# EAGLE design quadcopter (EAGLE 8.1.0)
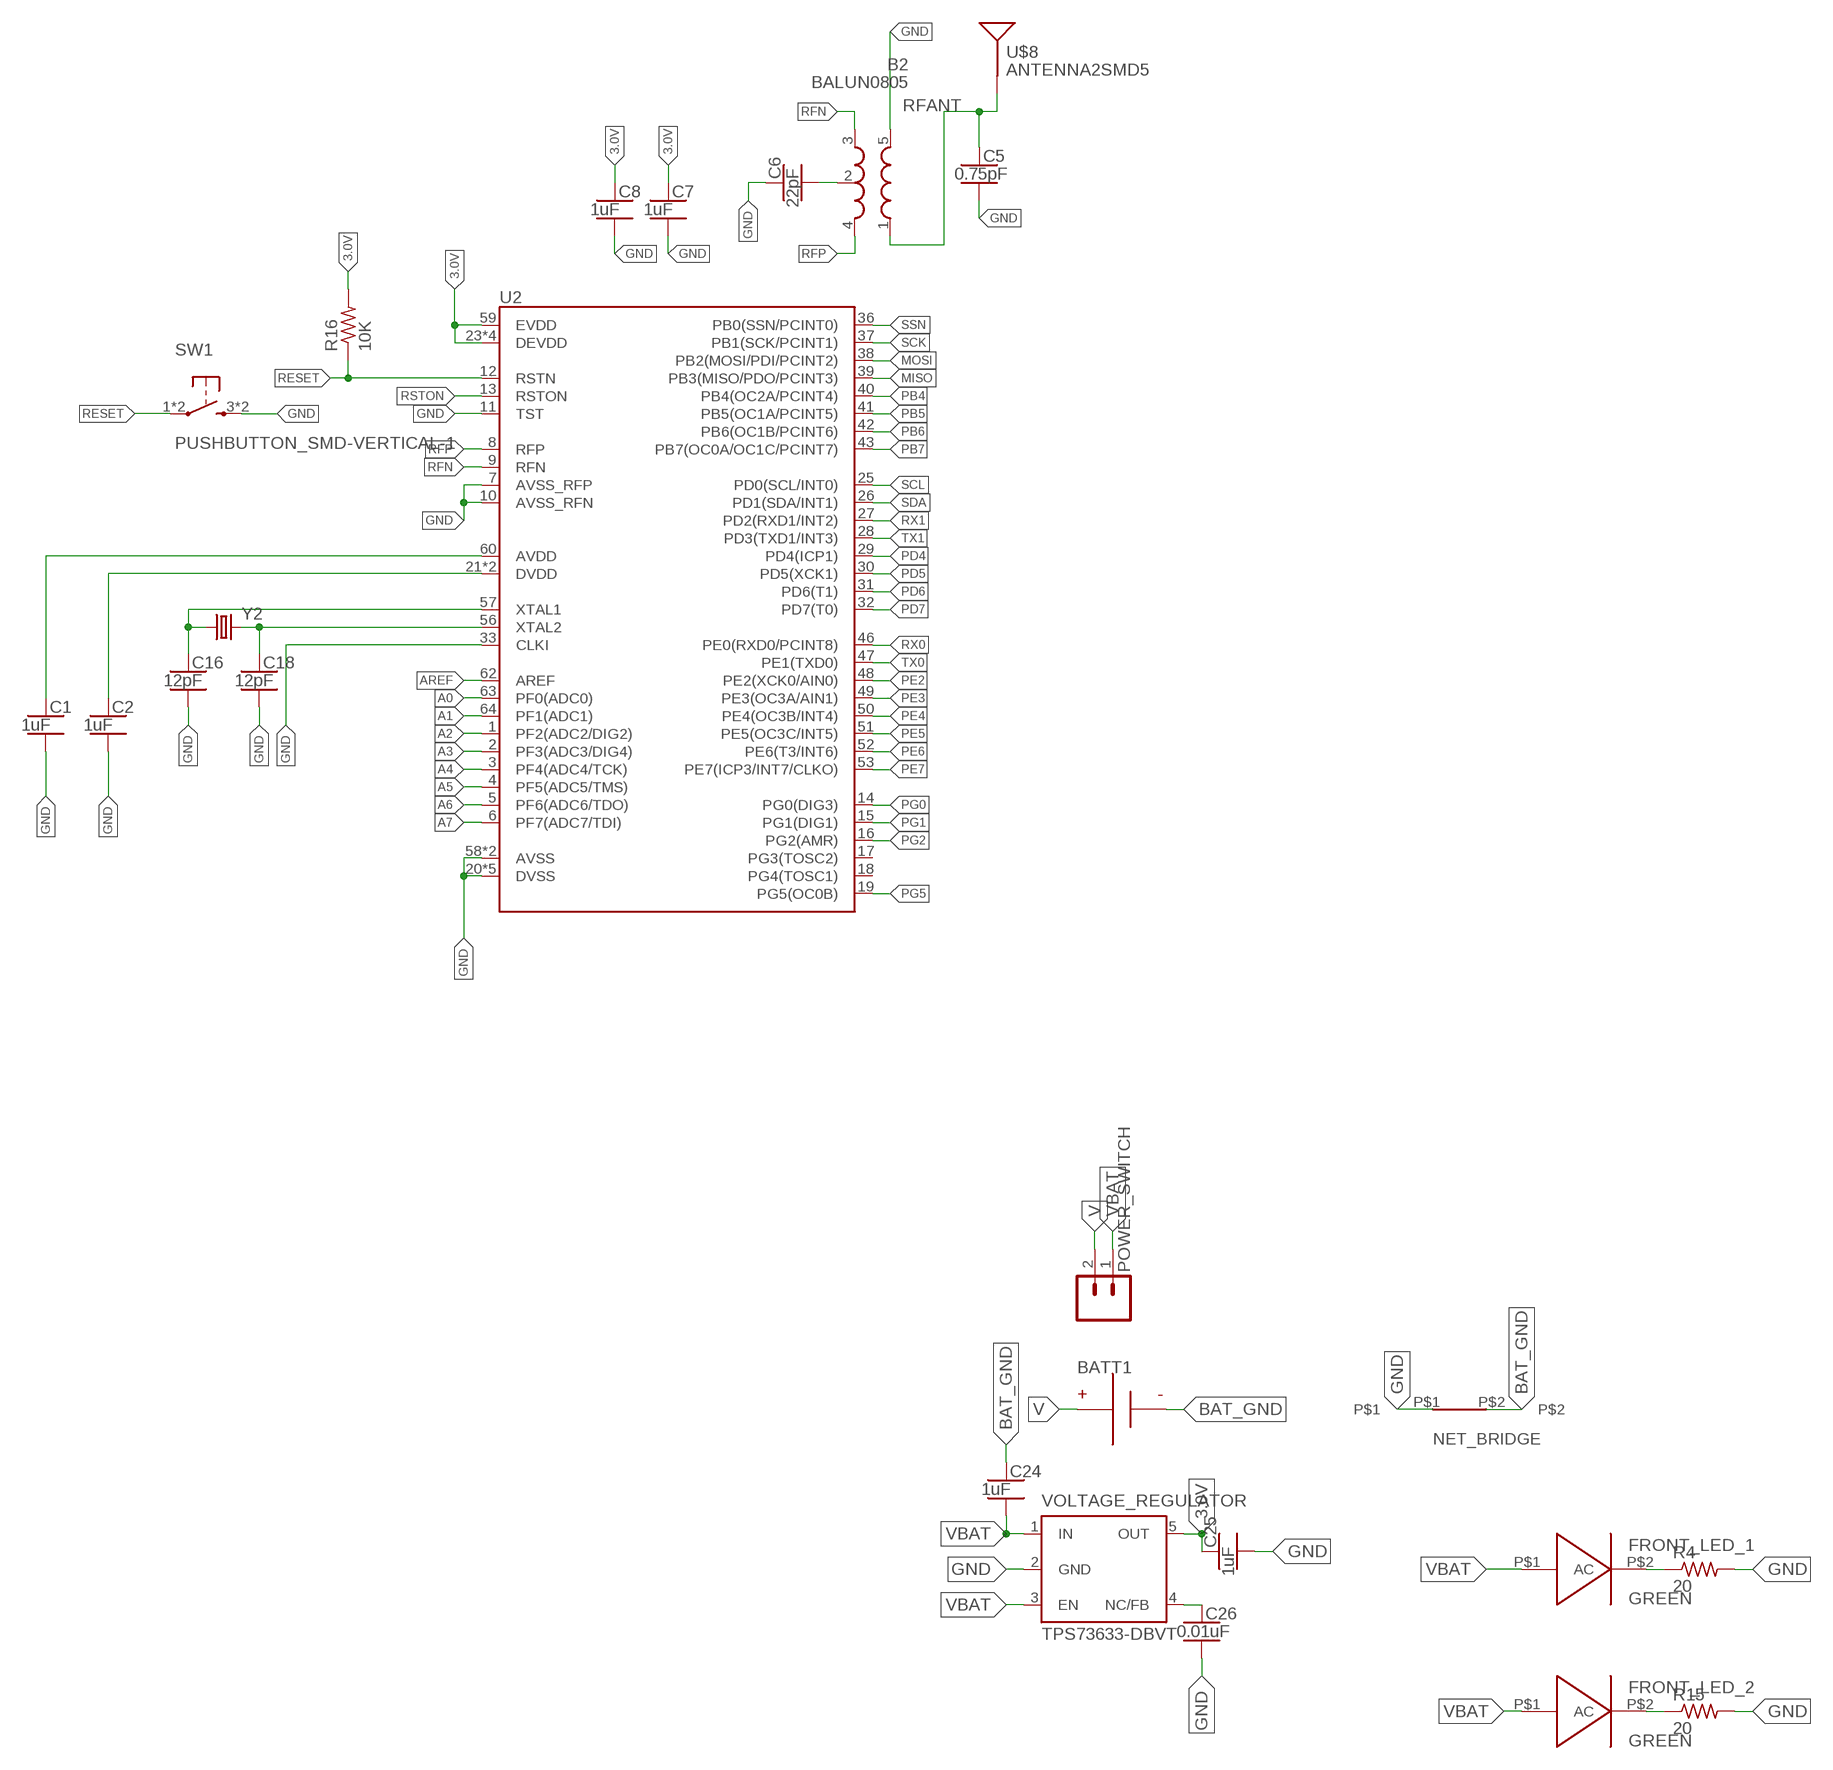
[diagram p0: schematic, sheet 1, part 1 of 2]
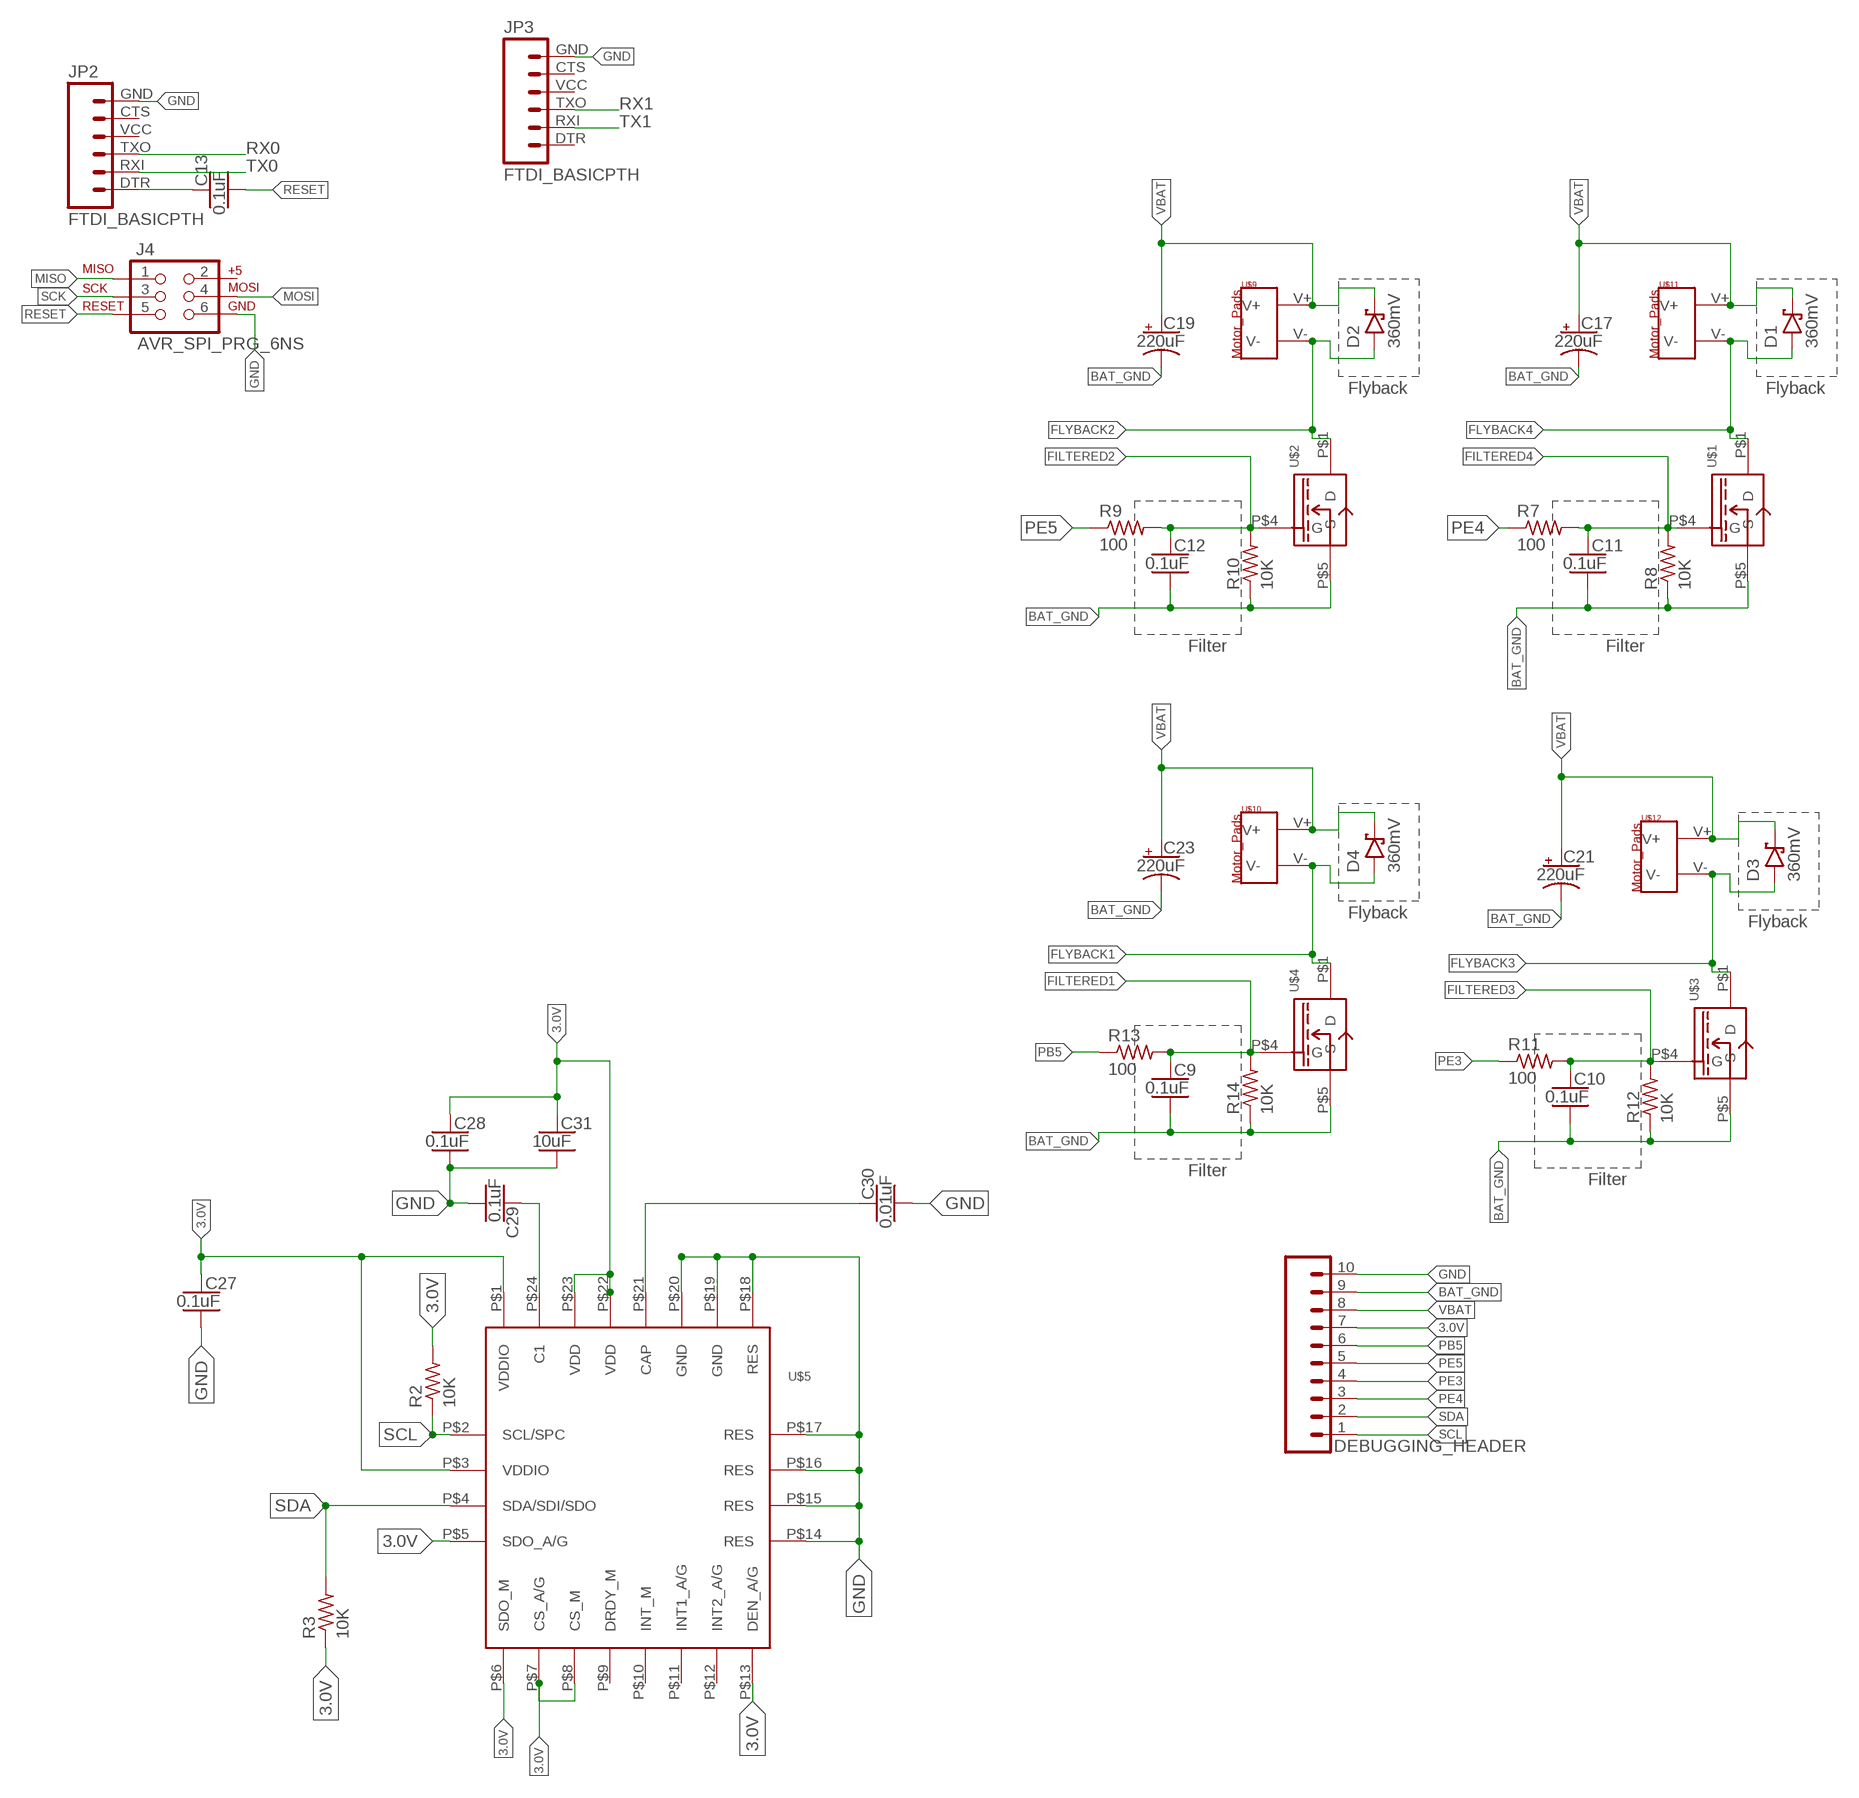
[diagram p1: schematic, sheet 1, part 2 of 2]

## Parts
B2  BALUN0805  [BALUN]
BATT1  BATTERY-HUBSAN-W/HOLDER  [BATTERY-W/HOLDER-380MAH-HUBSAN]
C1  1uF  CAPACITOR-NP_SMD-2012-0805_CERAMIC-1UF  [CAPC2012X140_HS]
C2  1uF  CAPACITOR-NP_SMD-2012-0805_CERAMIC-1UF  [CAPC2012X140_HS]
C5  0.75pF  CAPACITOR-NP_SMD-2012-0805_CERAMIC-0.75PF  [CAPC2012X140_HS]
C6  22pF  CAPACITOR-NP_SMD-2012-0805_CERAMIC-22PF  [CAPC2012X140_HS]
C7  1uF  CAPACITOR-NP_SMD-2012-0805_CERAMIC-1UF  [CAPC2012X140_HS]
C8  1uF  CAPACITOR-NP_SMD-2012-0805_CERAMIC-1UF  [CAPC2012X140_HS]
C9  0.1uF  CAPACITOR-NP_SMD-2012-0805_CERAMIC-0.1UF  [CAPC2012X140_HS]
C10  0.1uF  CAPACITOR-NP_SMD-2012-0805_CERAMIC-0.1UF  [CAPC2012X140_HS]
C11  0.1uF  CAPACITOR-NP_SMD-2012-0805_CERAMIC-0.1UF  [CAPC2012X140_HS]
C12  0.1uF  CAPACITOR-NP_SMD-2012-0805_CERAMIC-0.1UF  [CAPC2012X140_HS]
C13  0.1uF  CAPACITOR-NP_SMD-2012-0805_CERAMIC-0.1UF  [CAPC2012X140_HS]
C16  12pF  CAPACITOR-NP_SMD-2012-0805_CERAMIC-12PF  [CAPC2012X140_HS]
C17  220uF  CAPACITOR-POL_SMD-7043-D_TANTALUM-220UF  [CAPMP7343X310_HS]
C18  12pF  CAPACITOR-NP_SMD-2012-0805_CERAMIC-12PF  [CAPC2012X140_HS]
C19  220uF  CAPACITOR-POL_SMD-7043-D_TANTALUM-220UF  [CAPMP7343X310_HS]
C21  220uF  CAPACITOR-POL_SMD-7043-D_TANTALUM-220UF  [CAPMP7343X310_HS]
C23  220uF  CAPACITOR-POL_SMD-7043-D_TANTALUM-220UF  [CAPMP7343X310_HS]
C24  1uF  CAPACITOR-NP_SMD-2012-0805_CERAMIC-1UF  [CAPC2012X140_HS]
C25  1uF  CAPACITOR-NP_SMD-2012-0805_CERAMIC-1UF  [CAPC2012X140_HS]
C26  0.01uF  CAPACITOR-NP_SMD-2012-0805_CERAMIC-0.01UF  [CAPC2012X140_HS]
C27  0.1uF  CAPACITOR-NP_SMD-2012-0805_CERAMIC-0.1UF  [CAPC2012X140_HS]
C28  0.1uF  CAPACITOR-NP_SMD-2012-0805_CERAMIC-0.1UF  [CAPC2012X140_HS]
C29  0.1uF  CAPACITOR-NP_SMD-2012-0805_CERAMIC-0.1UF  [CAPC2012X140_HS]
C30  0.01uF  CAPACITOR-NP_SMD-2012-0805_CERAMIC-0.01UF  [CAPC2012X140_HS]
C31  10uF  CAPACITOR-NP_SMD-2012-0805_CERAMIC-10UF  [CAPC2012X140_HS]
D1  360mV  DIODE-SCHOTTKY_SMD-SOD123-360MV  [SOD3716X135_HS]
D2  360mV  DIODE-SCHOTTKY_SMD-SOD123-360MV  [SOD3716X135_HS]
D3  360mV  DIODE-SCHOTTKY_SMD-SOD123-360MV  [SOD3716X135_HS]
D4  360mV  DIODE-SCHOTTKY_SMD-SOD123-360MV  [SOD3716X135_HS]
DEBUGGING_HEADER  SIP-10_TH-254X10-1  [HDRV10W63P254_10X1_2540X254H838_HS]
FRONT_LED_1  GREEN  LED-0805-GREEN  [KINGBRIGHT_LED]
FRONT_LED_2  GREEN  LED-0805-GREEN  [KINGBRIGHT_LED]
J4  AVR_SPI_PRG_6NS  [2X3-NS]
JP2  FTDI_BASICPTH  [FTDI_BASIC]
JP3  FTDI_BASICPTH  [FTDI_BASIC]
NET_BRIDGE  NET_BRIDGE  [NET_BRIDGE]
POWER_SWITCH  MALE_HEADER_2POS-2X1-0.1IN  [MALE_HEADER_2X1_0.1IN]
R2  10K  RESISTOR_SMD-2012-0805-10K  [RESC2012X60_HS]
R3  10K  RESISTOR_SMD-2012-0805-10K  [RESC2012X60_HS]
R4  20  RESISTOR_SMD-2012-0805-20  [RESC2012X60_HS]
R7  100  RESISTOR_SMD-2012-0805-100  [RESC2012X60_HS]
R8  10K  RESISTOR_SMD-2012-0805-10K  [RESC2012X60_HS]
R9  100  RESISTOR_SMD-2012-0805-100  [RESC2012X60_HS]
R10  10K  RESISTOR_SMD-2012-0805-10K  [RESC2012X60_HS]
R11  100  RESISTOR_SMD-2012-0805-100  [RESC2012X60_HS]
R12  10K  RESISTOR_SMD-2012-0805-10K  [RESC2012X60_HS]
R13  100  RESISTOR_SMD-2012-0805-100  [RESC2012X60_HS]
R14  10K  RESISTOR_SMD-2012-0805-10K  [RESC2012X60_HS]
R15  20  RESISTOR_SMD-2012-0805-20  [RESC2012X60_HS]
R16  10K  RESISTOR_SMD-2012-0805-10K  [RESC2012X60_HS]
SW1  PUSHBUTTON_SMD-VERTICAL-1  [TE_FSM8JSMA_HS]
U2  ATMEGA128RFA1  [QFN-64]
U$1  MOFSET_SI2302CDS-T1-E3CT-ND  [MOFSET_SI2302CDS-T1-E3CT-ND]
U$2  MOFSET_SI2302CDS-T1-E3CT-ND  [MOFSET_SI2302CDS-T1-E3CT-ND]
U$3  MOFSET_SI2302CDS-T1-E3CT-ND  [MOFSET_SI2302CDS-T1-E3CT-ND]
U$4  MOFSET_SI2302CDS-T1-E3CT-ND  [MOFSET_SI2302CDS-T1-E3CT-ND]
U$5  IMU_497-14946-1-ND  [IMU_497-14946-1-ND]
U$8  ANTENNA2SMD5  [ANTENNA-CHIP5]
U$9  MOTOR_PADS  [MOTOR_PADS]
U$10  MOTOR_PADS  [MOTOR_PADS]
U$11  MOTOR_PADS  [MOTOR_PADS]
U$12  MOTOR_PADS  [MOTOR_PADS]
VOLTAGE_REGULATOR  TPS73633-DBVT  [SOT23-DBV]
Y2  CRYSTAL5X3  [CRYSTAL-SMD-5X3]

## Nets
3.0V: C7.1 C8.1 C25.1 C27.1 C28.1 C31.1 DEBUGGING_HEADER.7 R2.2 R3.1 R16.2 U2.23(DEVDD) U2.34(DEVDD) U2.44(DEVDD) U2.54(DEVDD) U2.59(EVDD) U$5.P$1(VDDIO) U$5.P$3(VDDIO) U$5.P$5(SDO_A/G) U$5.P$6(SDO_M) U$5.P$7(CS_A/G) U$5.P$8(CS_M) U$5.P$13(DEN_A/G) U$5.P$22(VDD) U$5.P$23(VDD) VOLTAGE_REGULATOR.5(OUT)
A0: U2.63(PF0(ADC0))
A1: U2.64(PF1(ADC1))
A2: U2.1(PF2(ADC2/DIG2))
A3: U2.2(PF3(ADC3/DIG4))
A4: U2.3(PF4(ADC4/TCK))
A5: U2.4(PF5(ADC5/TMS))
A6: U2.5(PF6(ADC6/TDO))
A7: U2.6(PF7(ADC7/TDI))
AREF: U2.62(AREF)
AVDD: C1.1 U2.60(AVDD)
BAT_GND [HIGHCURRENT]: BATT1.-(N) C9.2 C10.2 C11.2 C12.2 C17.2(-) C19.2(-) C21.2(-) C23.2(-) C24.1 DEBUGGING_HEADER.9 NET_BRIDGE.P$2 R8.1 R10.1 R12.1 R14.1 U$1.P$5(S) U$2.P$5(S) U$3.P$5(S) U$4.P$5(S)
DTR: C13.1 JP2.DTR
DVDD: C2.1 U2.21(DVDD) U2.22(DVDD)
FILTERED1 [HIGHCURRENT]: C9.1 R13.2 R14.2 U$4.P$4(G)
FILTERED2 [HIGHCURRENT]: C12.1 R9.2 R10.2 U$2.P$4(G)
FILTERED3 [HIGHCURRENT]: C10.1 R11.2 R12.2 U$3.P$4(G)
FILTERED4 [HIGHCURRENT]: C11.1 R7.2 R8.2 U$1.P$4(G)
FLYBACK1 [HIGHCURRENT]: D4.A U$4.P$1(D) U$10.V-
FLYBACK2 [HIGHCURRENT]: D2.A U$2.P$1(D) U$9.V-
FLYBACK3 [HIGHCURRENT]: D3.A U$3.P$1(D) U$12.V-
FLYBACK4 [HIGHCURRENT]: D1.A U$1.P$1(D) U$11.V-
GND: B2.5(GND) C1.2 C2.2 C5.2 C6.1 C7.2 C8.2 C16.2 C18.2 C25.2 C26.2 C27.2 C28.2 C29.2 C30.2 C31.2 DEBUGGING_HEADER.10 J4.6 JP2.GND JP3.GND NET_BRIDGE.P$1 R4.2 R15.2 SW1.3 SW1.4 U2.7(AVSS_RFP) U2.10(AVSS_RFN) U2.11(TST) U2.20(DVSS) U2.24(DVSS) U2.33(CLKI) U2.35(DVSS) U2.45(DVSS) U2.55(DVSS) U2.58(AVSS) U2.61(AVSS) U$5.P$14(RES) U$5.P$15(RES) U$5.P$16(RES) U$5.P$17(RES) U$5.P$18(RES) U$5.P$19(GND) U$5.P$20(GND) VOLTAGE_REGULATOR.2(GND)
MISO: J4.1 U2.39(PB3(MISO/PDO/PCINT3))
MOSI: J4.4 U2.38(PB2(MOSI/PDI/PCINT2))
N$1: FRONT_LED_1.P$2(C) R4.1
N$2: C30.1 U$5.P$21(CAP)
N$5: FRONT_LED_2.P$2(C) R15.1
N$7: B2.2(GND) C6.2
N$10: C29.1 U$5.P$24(C1)
N$12: C16.1 U2.57(XTAL1) Y2.1
N$14: C18.1 U2.56(XTAL2) Y2.3
N$18: C26.1 VOLTAGE_REGULATOR.4(NC/FB)
PB4: U2.40(PB4(OC2A/PCINT4))
PB5: DEBUGGING_HEADER.6 R13.1 U2.41(PB5(OC1A/PCINT5))
PB6: U2.42(PB6(OC1B/PCINT6))
PB7: U2.43(PB7(OC0A/OC1C/PCINT7))
PD4: U2.29(PD4(ICP1))
PD5: U2.30(PD5(XCK1))
PD6: U2.31(PD6(T1))
PD7: U2.32(PD7(T0))
PE2: U2.48(PE2(XCK0/AIN0))
PE3: DEBUGGING_HEADER.4 R11.1 U2.49(PE3(OC3A/AIN1))
PE4: DEBUGGING_HEADER.3 R7.1 U2.50(PE4(OC3B/INT4))
PE5: DEBUGGING_HEADER.5 R9.1 U2.51(PE5(OC3C/INT5))
PE6: U2.52(PE6(T3/INT6))
PE7: U2.53(PE7(ICP3/INT7/CLKO))
PG0: U2.14(PG0(DIG3))
PG1: U2.15(PG1(DIG1))
PG2: U2.16(PG2(AMR))
PG5: U2.19(PG5(OC0B))
RESET: C13.2 J4.5 R16.1 SW1.1 SW1.2 U2.12(RSTN)
RFANT [RFSIG]: B2.1(IN) C5.1 U$8.FEED(SIGNAL)
RFN: B2.3(OUT2) U2.9(RFN)
RFP: B2.4(OUT1) U2.8(RFP)
RSTON: U2.13(RSTON)
RX0: JP2.TXO U2.46(PE0(RXD0/PCINT8))
RX1: JP3.TXO U2.27(PD2(RXD1/INT2))
SCK: J4.3 U2.37(PB1(SCK/PCINT1))
SCL: DEBUGGING_HEADER.1 R2.1 U2.25(PD0(SCL/INT0)) U$5.P$2(SCL/SPC)
SDA: DEBUGGING_HEADER.2 R3.2 U2.26(PD1(SDA/INT1)) U$5.P$4(SDA/SDI/SDO)
SSN: U2.36(PB0(SSN/PCINT0))
TX0: JP2.RXI U2.47(PE1(TXD0))
TX1: JP3.RXI U2.28(PD3(TXD1/INT3))
V: BATT1.+(P) POWER_SWITCH.2
VBAT [HIGHCURRENT]: C17.1(+) C19.1(+) C21.1(+) C23.1(+) C24.2 D1.C D2.C D3.C D4.C DEBUGGING_HEADER.8 FRONT_LED_1.P$1(A) FRONT_LED_2.P$1(A) POWER_SWITCH.1 U$9.V+ U$10.V+ U$11.V+ U$12.V+ VOLTAGE_REGULATOR.1(IN) VOLTAGE_REGULATOR.3(EN)
Unconnected: J4.2 JP2.CTS JP2.VCC JP3.CTS JP3.DTR JP3.VCC U2.17(PG3(TOSC2)) U2.18(PG4(TOSC1)) U$5.P$9(DRDY_M) U$5.P$10(INT_M) U$5.P$11(INT1_A/G) U$5.P$12(INT2_A/G)

## Notes on the sheet
- Flyback | Flyback
- Filter | Filter
- Flyback
- Flyback
- Filter
- Filter

## Library data of the parts
B2 = quadparts_prebuilt:BALUN: 0805 footprint balun- Ember 351/357; DATASHEET: http://katalog.we-online.de/pbs/datasheet/748421245.pdf; DIST: Digikey; DISTPN: 732-2230-6-ND; MFR: Wurth Electronics Inc; MPN: 748421245; PRICE: 2.63
BATT1 = quadparts_prebuilt:BATTERY; CREATOR: Swanson; DIST: AMAZON; DISTPN: http://www.amazon.com/dp/B00RROB6Q4?smid=AMNTPWSAB5H0S; MFR: HUBSAN; MPN: X4-H107C-8-in-1
C1 C2 C7 C8 C24 C25 = quadparts_prebuilt:CAPACITOR-NP_: Nonpolarized capacitor; DIST: Digikey; DISTPN: 490-4736-1-ND; MFR: Murata Electronics North America; MPN: GRM21BR71H105KA12L
C5 = quadparts_prebuilt:CAPACITOR-NP_: Nonpolarized capacitor; DIST: Digikey; DISTPN: 490-3585-1-ND; MFR: Murata Electronics North America; MPN: GQM2195C2AR75CB01D
C6 = quadparts_prebuilt:CAPACITOR-NP_: Nonpolarized capacitor; DIST: Digikey; DISTPN: 490-5534-1-ND; MFR: Murata Electronics North America; MPN: GRM21A5C2E220JW01D
C9-C13 C27-C29 = quadparts_prebuilt:CAPACITOR-NP_: Nonpolarized capacitor; DIST: Digikey; DISTPN: 490-1666-1-ND; MFR: Murata Electronics North America; MPN: GRM21BR71H104KA01L
C16 C18 = quadparts_prebuilt:CAPACITOR-NP_: Nonpolarized capacitor; DIST: Digikey; DISTPN: 490-5531-1-ND; MFR: Murata Electronics North America; MPN: GRM21A5C2E120JW01D
C17 C19 C21 C23 = quadparts_prebuilt:CAPACITOR-POL_: Polarized capacitor; DIST: Digikey; DISTPN: 478-8912-1-ND; MFR: AVX Corporation; MPN: TAJD227K006RNJ
C26 C30 = quadparts_prebuilt:CAPACITOR-NP_: Nonpolarized capacitor; DIST: Digikey; DISTPN: 490-8295-1-ND; MFR: Murata Electronics North America; MPN: GRM2195C1H103FA01D
C31 = quadparts_prebuilt:CAPACITOR-NP_: Nonpolarized capacitor; DIST: Digikey; DISTPN: 490-5523-1-ND; MFR: Murata Electronics North America; MPN: GRM21BR61E106KA73L
D1-D4 = quadparts_prebuilt:DIODE-SCHOTTKY_: Schottky diode; DIST: Digikey; DISTPN: CRS08QMCT-ND; MFR: Toshiba Semiconductor and Storage; MPN: CRS08(TE85L,Q,M)
DEBUGGING_HEADER = quadparts_prebuilt:SIP-10_: 10 pin single inline pin header, socket, or connector; DIST: Digikey; DISTPN: 609-3250-ND; MFR: Amphenol FCI; MPN: 68000-110HLF
FRONT_LED_1 FRONT_LED_2 = LEDs:LED; CREATOR: Chris Miranda; DIST: Digikey; DISTPN: 754-1795-1-ND; MFR: Kingbright; MPN: APT2012ZGCK; REVIEWER: Group3
J4 = quadparts_prebuilt:AVR_SPI_PRG_6: AVR ISP 6 Pin This is the reduced ISP connector for AVR programming. Common on Arduino. This footprint will take up less PCB space and can be used with a 10-pin to 6-pin adapter such as SKU: BOB-08508; DATASHEET: http://portal.fciconnect.com/Comergent//fci/drawing/67996.pdf; DIST: Digikey; DISTPN: 609-3234-ND; MFR: Amphenol FCI; MPN: 67997-206HLF; PRICE: 0.31
JP2 JP3 = quadparts_prebuilt:FTDI_BASIC: FTDI Basic header with labels; DATASHEET: http://portal.fciconnect.com/Comergent//fci/drawing/68015.pdf; DIST: Digikey; DISTPN: 609-3327-ND; MFR: Amphenol FCI; MPN: 68016-406HLF; PRICE: 0.33
NET_BRIDGE = quadparts_jay:NET_BRIDGE; CREATOR: Chris Miranda; DIST: none; DISTPN: none; MFR: none; MPN: none; REVIEWER: Group3
POWER_SWITCH = quadparts_jay:MALE_HEADER_2POS: 2 pin single inline pin header, socket, or connector; CREATOR: SWANSON; DIST: Digikey; DISTPN: 3M9447-ND; MFR: 3M; MPN: 961102-6404-AR; REVIEWER: Group3
R2 R3 R8 R10 R12 R14 R16 = quadparts_prebuilt:RESISTOR_: Resistor; DIST: Digikey; DISTPN: 311-10KARCT-ND; MFR: Yageo; MPN: RC0805JR-0710KL
R4 R15 = quadparts_prebuilt:RESISTOR_: Resistor; CREATOR: Chris Miranda; DIST: Digikey; DPN: 311-20ARCT-ND; MFR: Yageo; MPN: RC0805JR-0720RL
R7 R9 R11 R13 = quadparts_prebuilt:RESISTOR_: Resistor; DIST: Digikey; DISTPN: 311-100ARCT-ND; MFR: Yageo; MPN: RC0805JR-07100RL
SW1 = quadparts_prebuilt:PUSHBUTTON_: Pushbutton with 2 pins shorting 1 to 2 and two extra mounting pins 3 & 4; DIST: Digikey; DISTPN: 450-1129-ND; MFR: TE Connectivity Alcoswitch Switches; MPN: FSM4JSMA
U2 = quadparts_prebuilt:ATMEGA128RFA1: ATmega128RFA1 8-bit AVR Microcontroller with Low Power 2.4GHz Transceiver for ZigBee and IEEE 802.15.4; CREATOR: Swanson; DATASHEET: http://www.atmel.com/Images/Atmel-8266-MCU_Wireless-ATmega128RFA1_Datasheet.pdf; DIST: Digikey; DISTPN: ATMEGA128RFA1-ZUR00DKR-ND; MFR: Atmel; MPN: ATMEGA128RFA1-ZUR00; PRICE: 10.21
U$1-U$4 = quadparts_jay:MOFSET_SI2302CDS-T1-E3CT-ND: This is a MOFSET I have no idea what a MOFSET does, but if you were looking for one, this is it.; CREATOR: Jay Ives; DIST: Digikey; DISTPN: SI2302CDS-T1-E3CT-ND; MFR: Vishay Siliconix; MPN: SI2302CDS-T1-E3; REVIEWER: Group3
U$5 = quadparts_jay:IMU_497-14946-1-ND; CREATOR: Jay Ives; DIST: Digikey; DISTPN: 497-14946-1-ND; MFR: STMicroelectronics; MPN: LSM9DS1TR; REVIEWER: Group3
U$8 = quadparts_prebuilt:ANTENNA2: Chip antenna Single endded antenna. Common with smaller chip antennas. CHIP4 package is the GPS Chip Antenna SKU: GPS-08418. CHIP5 package is 2.4GHz chip antenna SKU: WRL-00144.; DATASHEET: http://www.linxtechnologies.com/resources/data-guides/ant-xxx-chp-x.pdf; DIST: Digikey; DISTPN: ANT-2.45-CHPCT-ND; MFR: Linx Technologies Inc.; MPN: ANT-2.45-CHP-T; PRICE: 3.16
U$9-U$12 = quadparts_prebuilt:MOTOR_PADS; DIST: NA; DISTPN: NA; MFR: NA; MPN: NA
VOLTAGE_REGULATOR = quadparts_prebuilt:TPS73633-DBVT; DATASHEET: http://www.ti.com/lit/ds/symlink/lp3985.pdf; DIST: Digikey; DISTPN: LP3985IM5X-3.0/NOPBCT-ND; MFR: Texas Instruments; MPN: LP3985IM5X-3.0/NOPB; PRICE: 0.59
Y2 = quadparts_prebuilt:CRYSTAL: Various standard crystals. Proven footprints.; DATASHEET: http://www.abracon.com/Resonators/abm3b.pdf; DIST: Digikey; DISTPN: 535-9122-1-ND; MFR: Abracon LLC; MPN: ABM3B-16.000MHZ-B2-T; PRICE: 0.68; PROD_ID: XTAL-08218

## Net classes
1 RFSIG: width 0.457 mm
2 HIGHCURRENT: width 0.457 mm

## Board
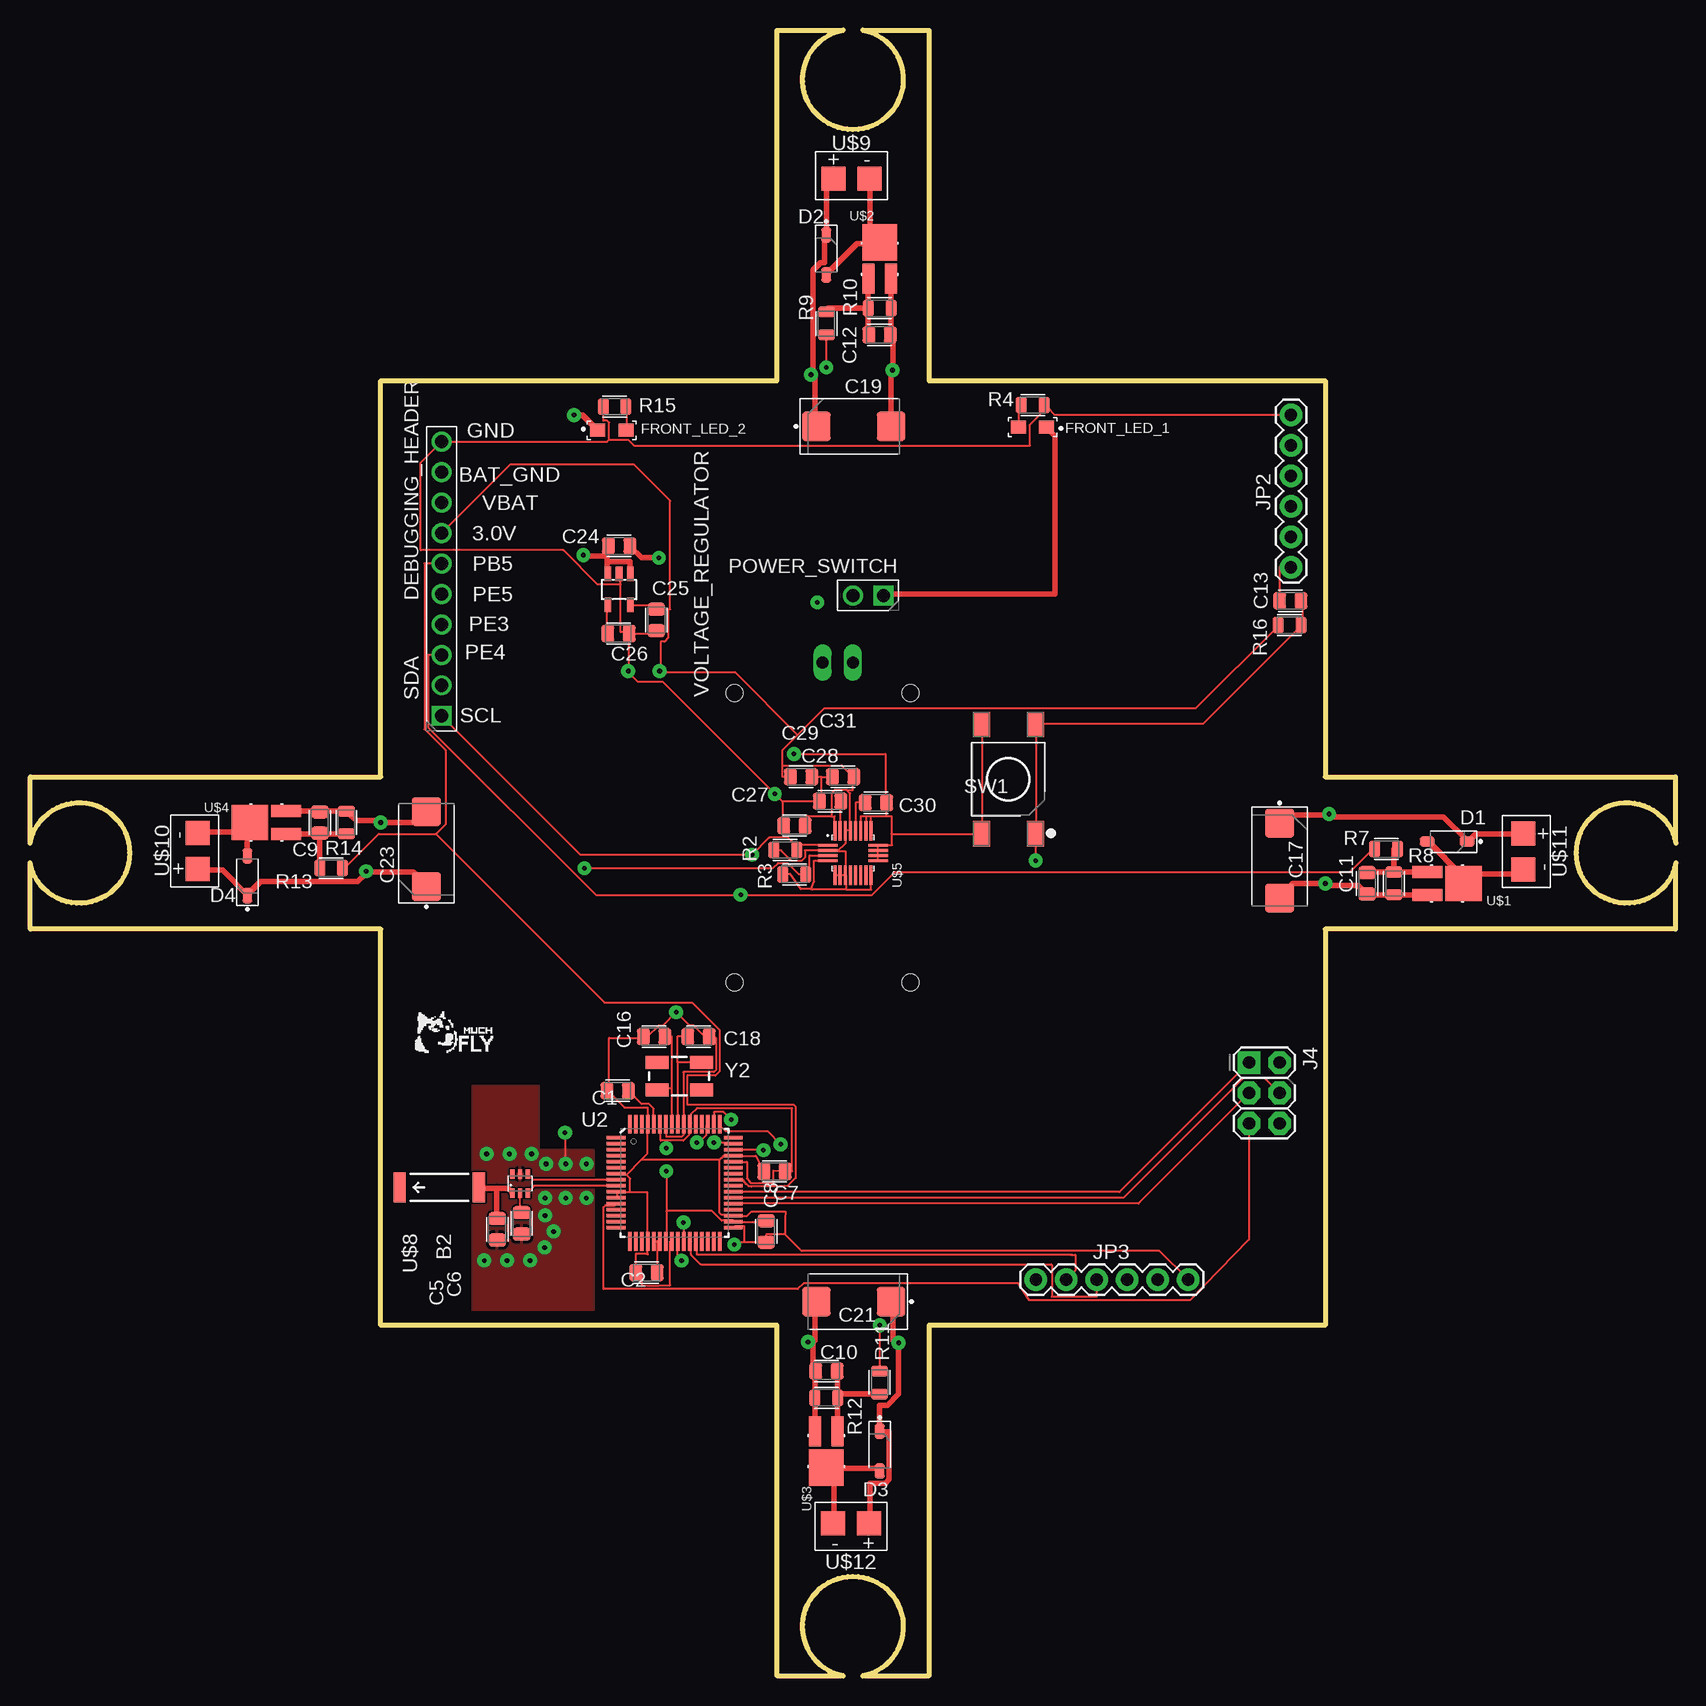
[diagram p2: board, top side]
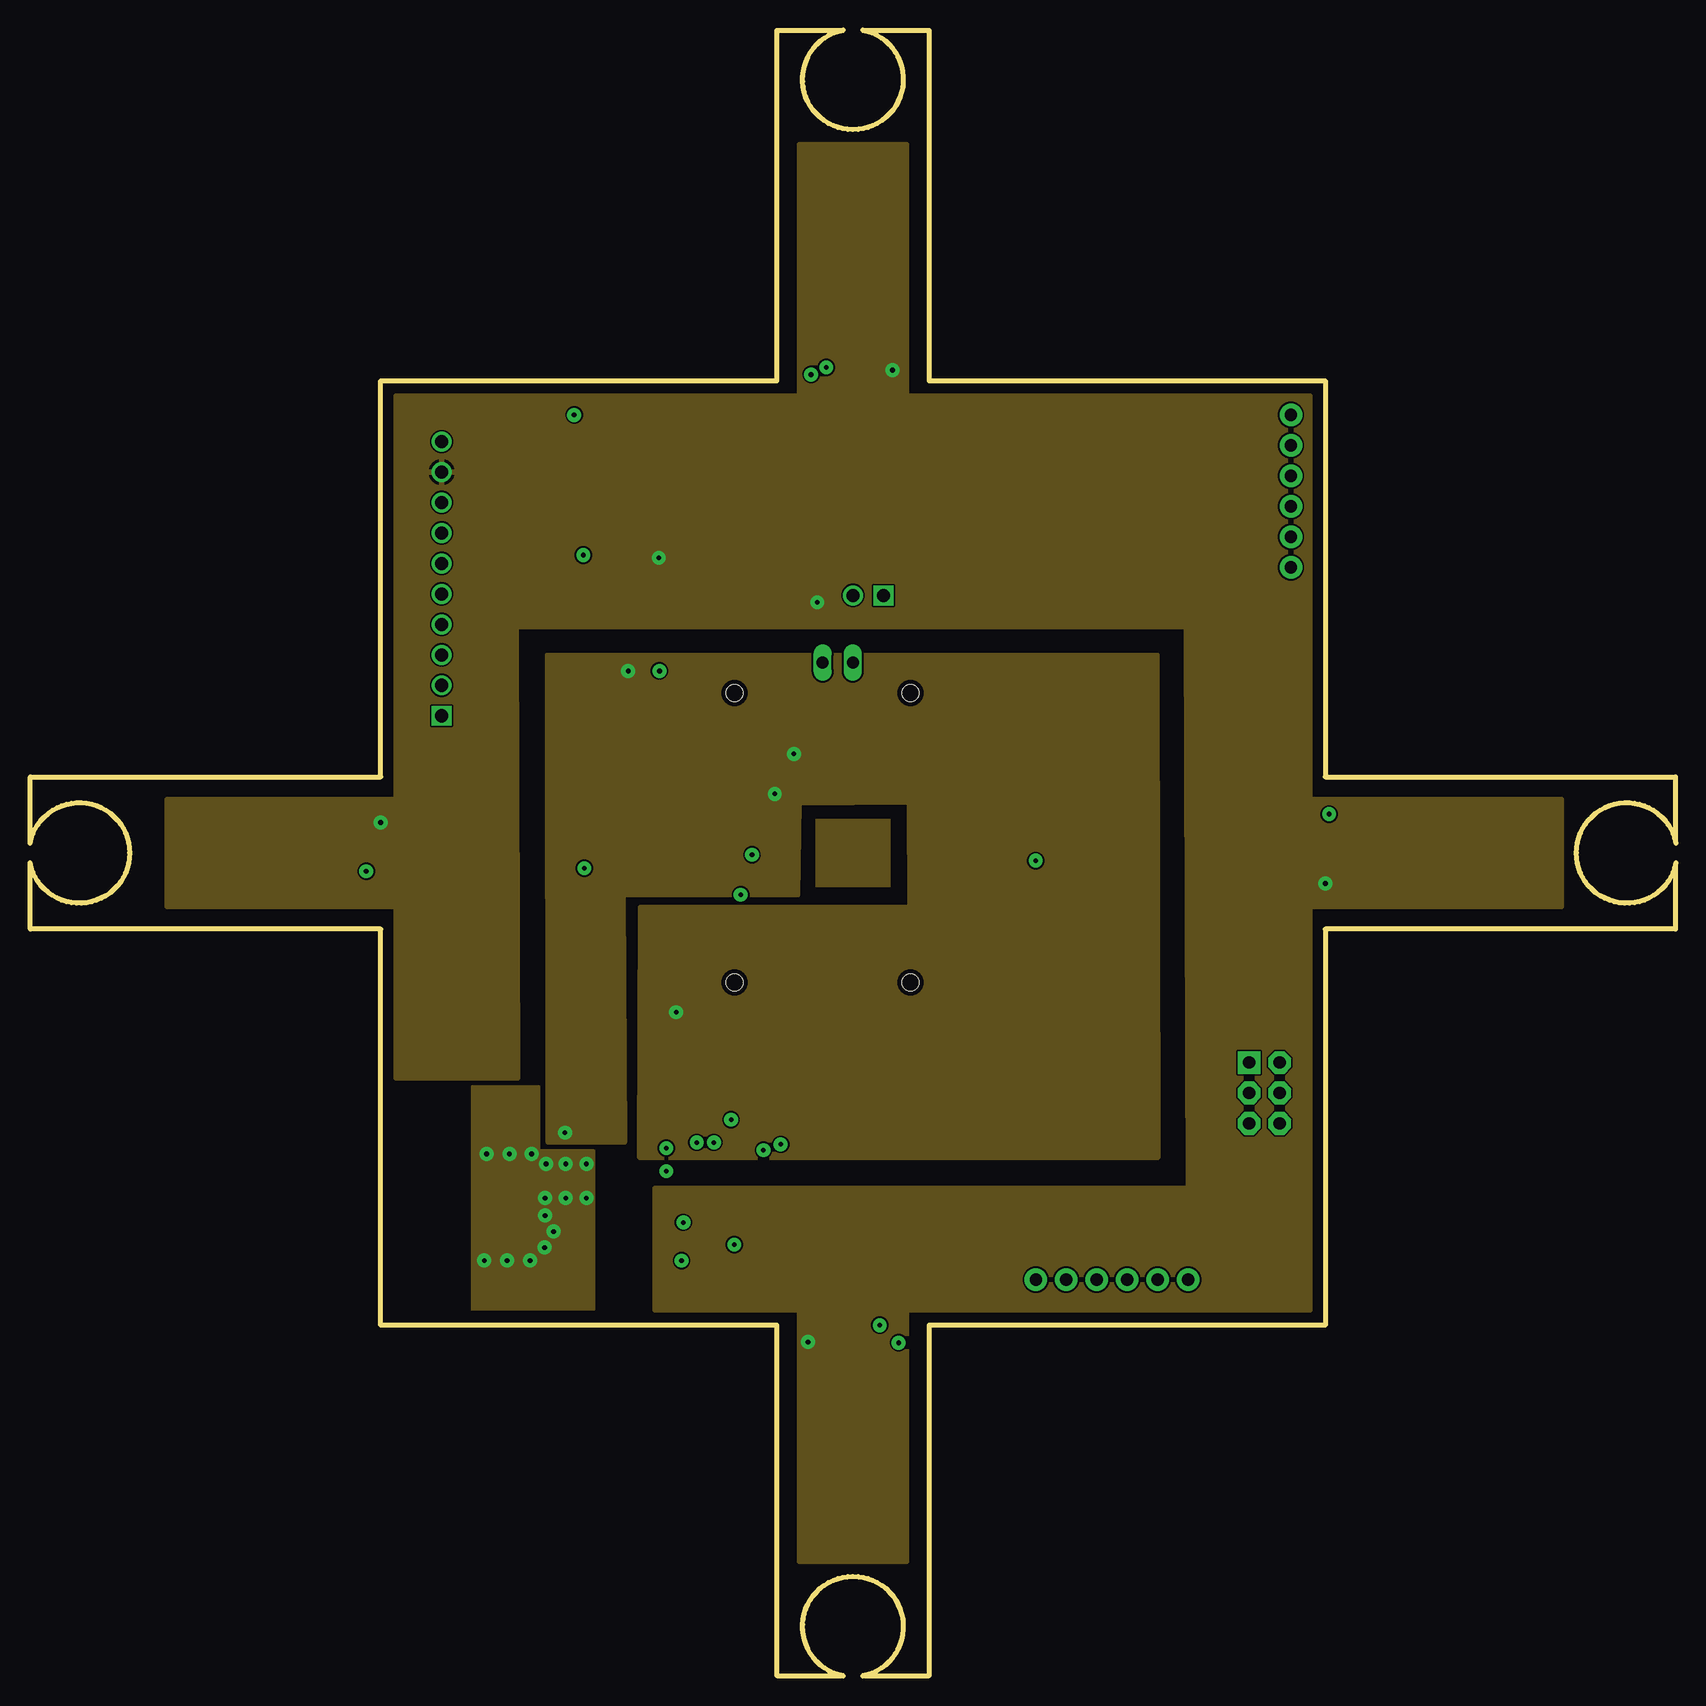
[diagram p3: board, inner layer Route2]
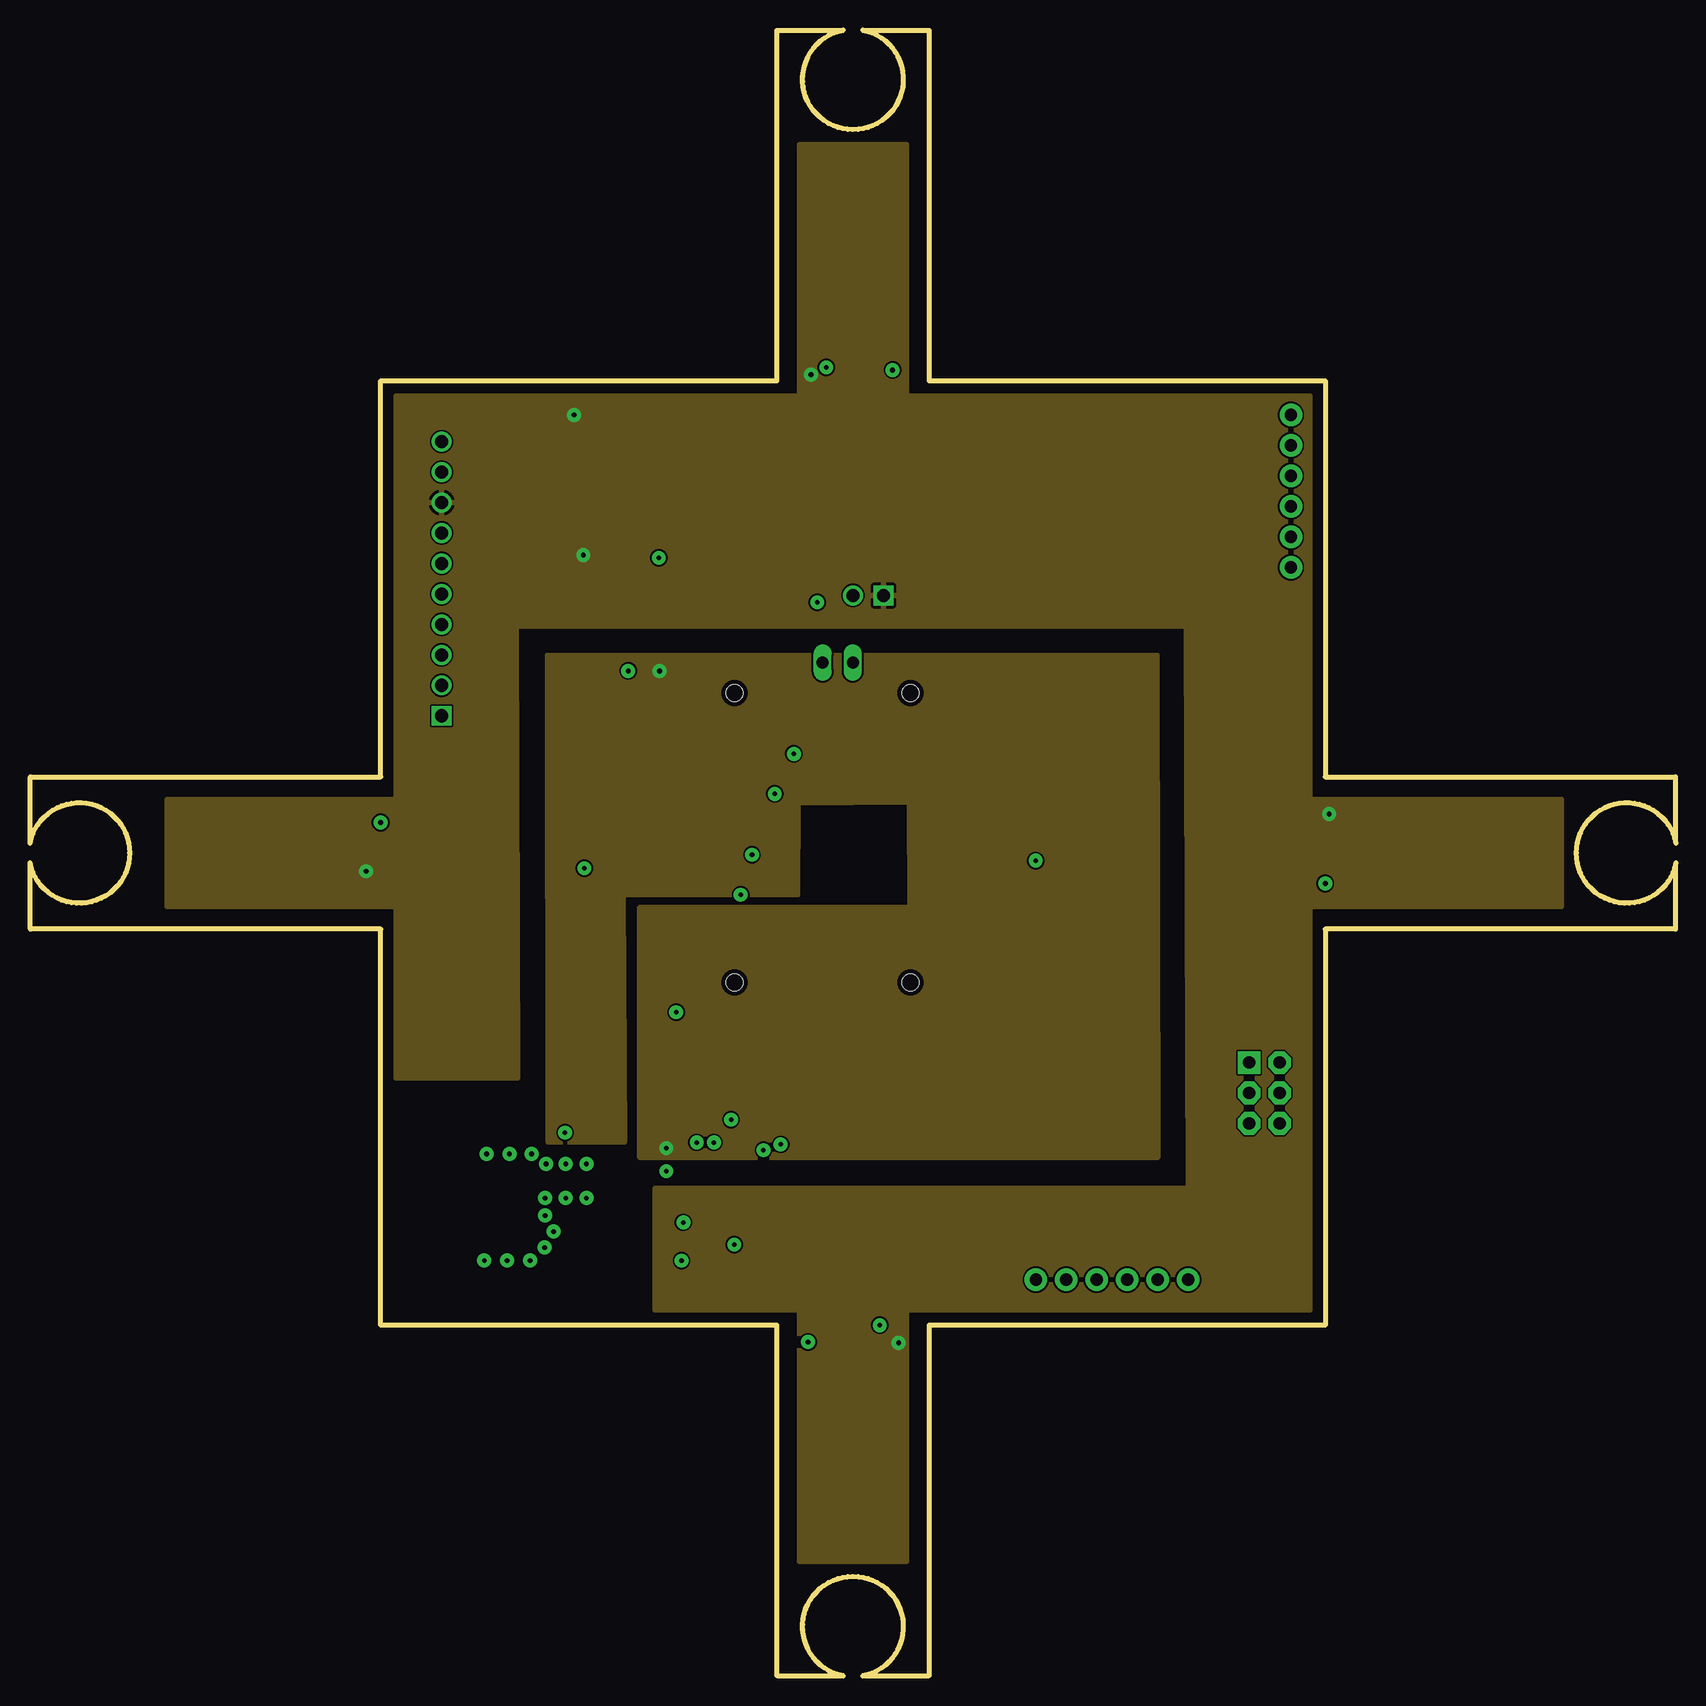
[diagram p4: board, inner layer Route15]
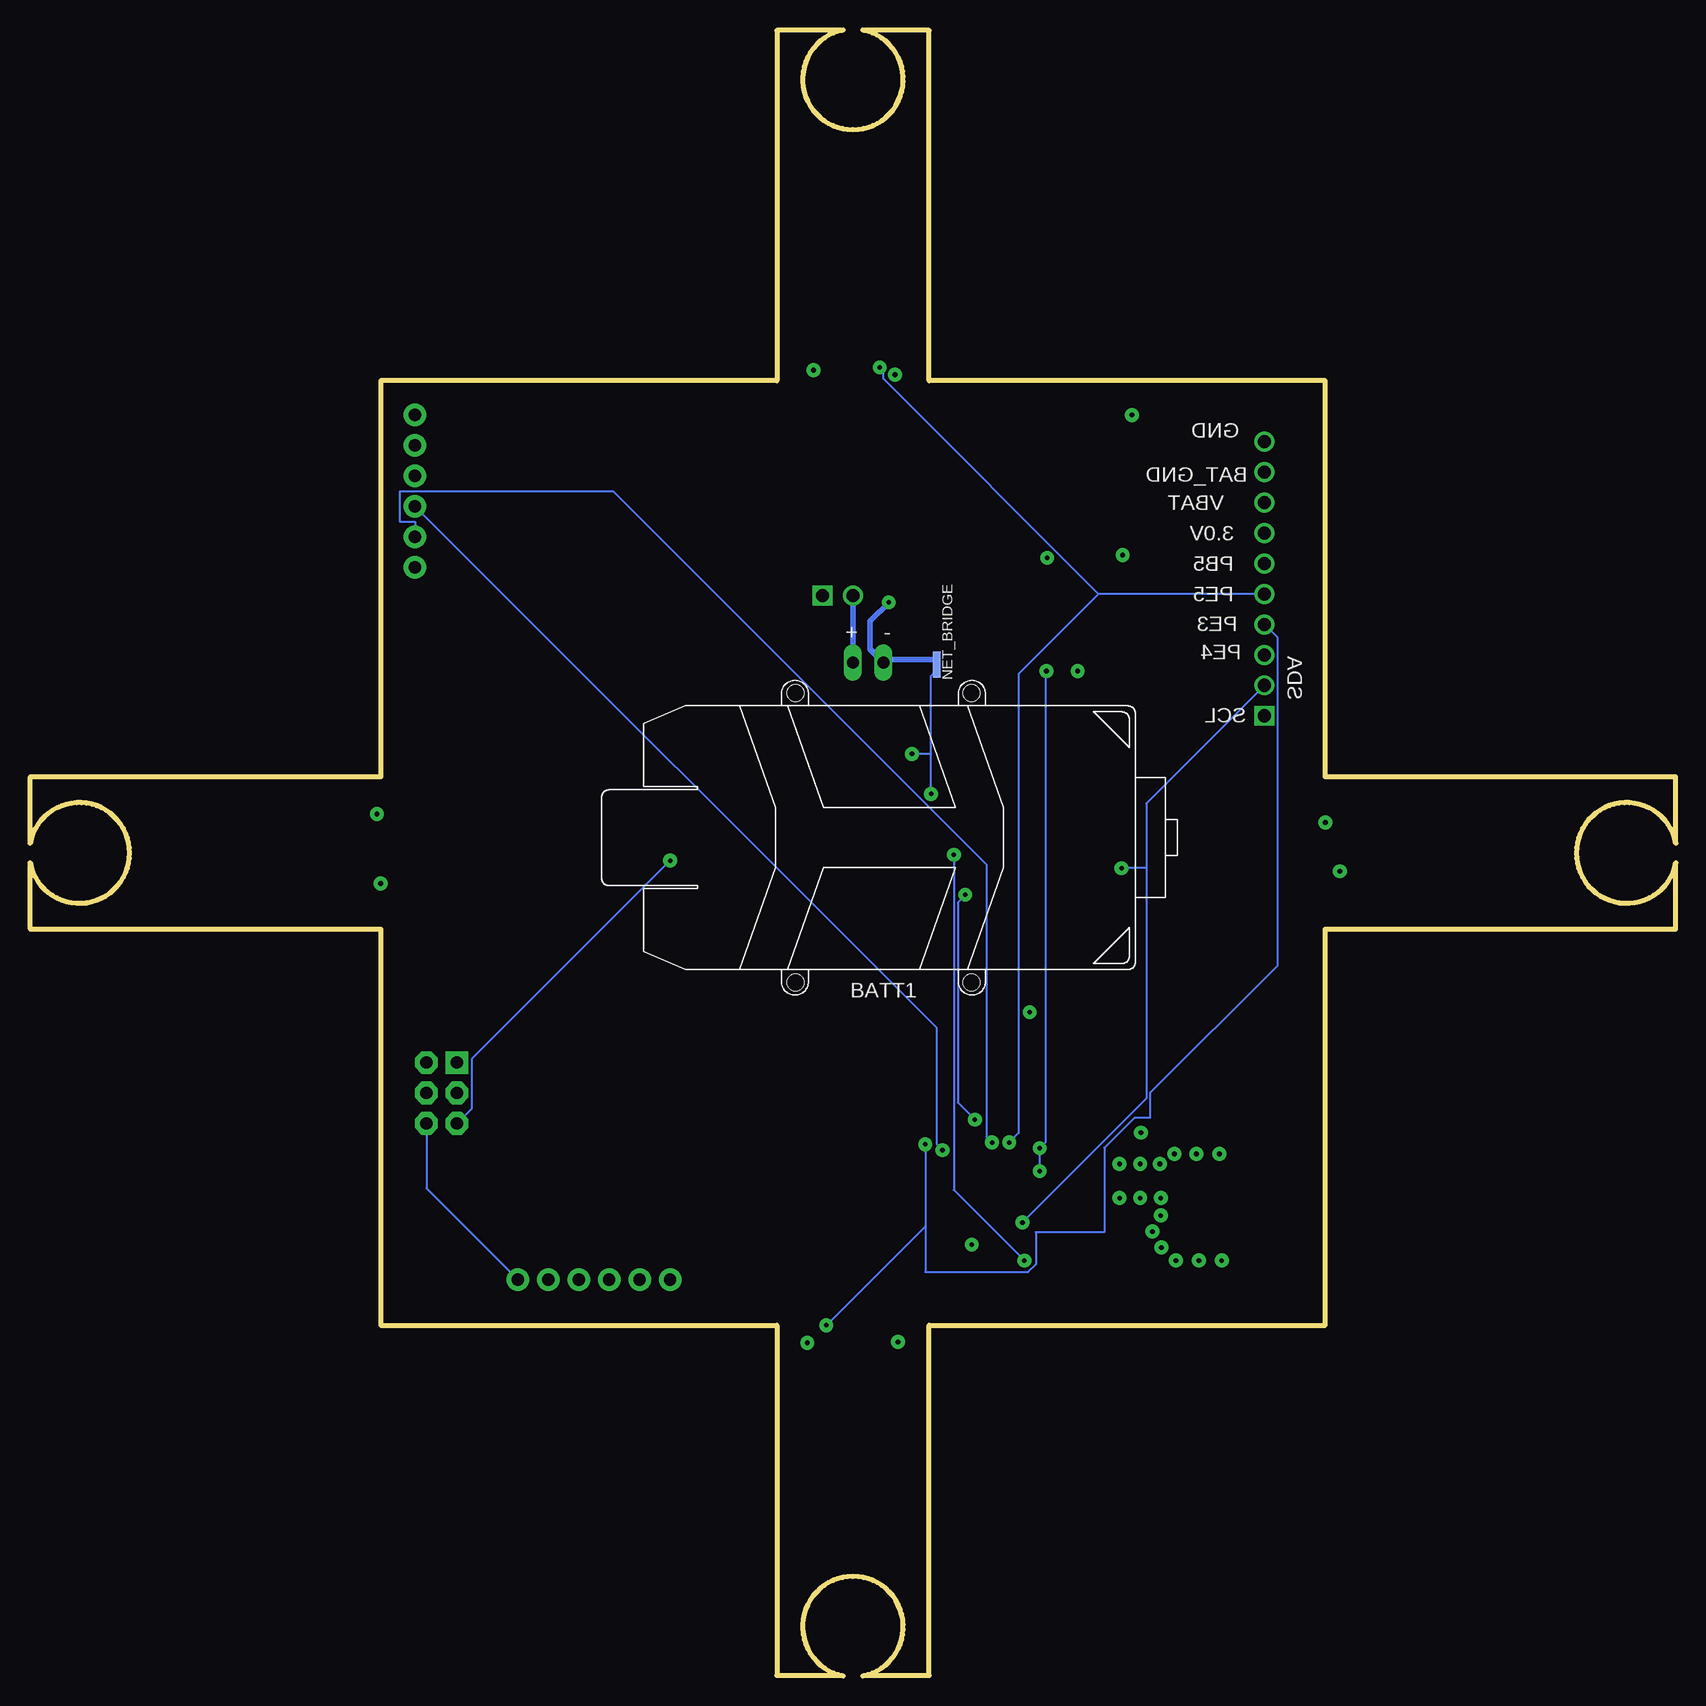
[diagram p5: board, bottom side, seen from below]

Size 137.21 x 137.21 mm. Coordinates in mm from the lower left corner, seen from the top.
Outline: 137.21,67.8 arc-338 137.21,69.4
Outline: 137.18,67.65 137.18,62.25 107.97,62.25 107.97,29.23 74.95,29.23 74.95,0.02 69.56,0.02
Outline: 137.18,69.56 137.18,74.95 107.97,74.95 107.97,107.97 74.95,107.97 74.95,137.18 69.56,137.18
Outline: 69.4,137.21 arc-338 67.8,137.21
Outline: 67.65,137.18 62.25,137.18 62.25,107.97 29.23,107.97 29.23,74.95 0.02,74.95 0.02,69.56
Outline: 0,69.4 arc-338 0,67.8
Outline: 0.02,67.65 0.02,62.25 29.23,62.25 29.23,29.23 62.25,29.23 62.25,0.02 67.65,0.02
Outline: 67.8,0 arc-338 69.4,0
Copper layers (1*2*15*16): Top 0.035559375mm / dielectric 1.501140625mm / Route2 0.035559375mm / dielectric 0.149859375mm / Route15 0.035559375mm / dielectric 0.200659375mm / Bottom 0.035559375mm
Design rules "4pcb-66board": minimum track width 6mil, minimum drill 15mil, track to track 6mil, track to pad 6mil, pad to pad 6mil, via to via 6mil, smd to smd 6mil, copper to edge 15mil, drill to drill 10mil, minimum pad ring 10mil, minimum via ring 15mil, stop-mask expansion 4mil, vias tented up to drill 0mil, thermal gap 10mil
bKeepout: area 36.9,30.3 to 47.2,49.4; 12 lines
tRestrict: area 29.7,29.9 to 36.5,49.3; 8 lines
bRestrict: area 65.6,65.8 to 71.7,71.4; area 29.7,30.2 to 36.4,49.3; 1 lines

### Footprints (pad centres in the part's own frame; a part is rotated, then mirrored left to right if it is on the bottom)
BALUN = smd 0.35 x 0.8: 1 -0.65,-0.8; 2 0,-0.8; 3 0.65,-0.8; 4 0.65,0.8; 5 0,0.8; 6 -0.65,0.8
BATTERY-W/HOLDER-380MAH-HUBSAN = drill 1 long: + -2.54,14.605; - 0,14.605 | hole 1.4: -7.35,-12.05; -7.35,12.05; 7.35,-12.05; 7.35,12.05
CAPC2012X140_HS = smd 1.08 x 1.42: 1 -0.895,0; 2 0.895,0
CAPMP7343X310_HS = smd 2.37 x 2.43: 1 -3.12,0; 2 3.12,0
SOD3716X135_HS = smd 1.25 x 0.8: A 1.665,0; C -1.665,0
HDRV10W63P254_10X1_2540X254H838_HS = drill 1.1 pad 1.65 square: 1 0,0 | drill 1.1 pad 1.65: 2 2.54,0; 3 5.08,0; 4 7.62,0; 5 10.16,0; 6 12.7,0; 7 15.24,0; 8 17.78,0; 9 20.32,0; 10 22.86,0
KINGBRIGHT_LED = smd 1.25 x 1.1: P$1 0,0; P$2 2.35,0
2X3-NS = drill 1.016 pad 1.88 square: 1 -2.54,-1.27 | drill 1.016 pad 1.88 octagon: 2 -2.54,1.27; 3 0,-1.27; 4 0,1.27; 5 2.54,-1.27; 6 2.54,1.27
FTDI_BASIC = drill 1.016 pad 1.88: CTS 10.16,0; DTR 0,0; GND 12.7,0; RXI 2.54,0; TXO 5.08,0; VCC 7.62,0
NET_BRIDGE = smd 1.27 x 0.635: P$1 0,0; P$2 0.9,0
MALE_HEADER_2X1_0.1IN = drill 1.1 pad 1.65 square: 1 0,0 | drill 1.1 pad 1.65: 2 2.54,0
RESC2012X60_HS = smd 0.92 x 1.38: 1 -0.955,0; 2 0.955,0
TE_FSM8JSMA_HS = smd 1.4 x 2.1: 1 -2.25,4.55; 2 -2.25,-4.55; 3 2.25,4.55; 4 2.25,-4.55
QFN-64 = smd 1.562 x 0.28: 1 -4.881,3.75; 2 -4.881,3.25; 3 -4.881,2.75; 4 -4.881,2.25; 5 -4.881,1.75; 6 -4.881,1.25; 7 -4.881,0.75; 8 -4.881,0.25; 9 -4.881,-0.25; 10 -4.881,-0.75; 11 -4.881,-1.25; 12 -4.881,-1.75; 13 -4.881,-2.25; 14 -4.881,-2.75; 15 -4.881,-3.25; 16 -4.881,-3.75; 33 4.881,-3.75; 34 4.881,-3.25; 35 4.881,-2.75; 36 4.881,-2.25; 37 4.881,-1.75; 38 4.881,-1.25; 39 4.881,-0.75; 40 4.881,-0.25; 41 4.881,0.25; 42 4.881,0.75; 43 4.881,1.25; 44 4.881,1.75; 45 4.881,2.25; 46 4.881,2.75; 47 4.881,3.25; 48 4.881,3.75 | smd 0.28 x 1.562: 17 -3.75,-4.881; 18 -3.25,-4.881; 19 -2.75,-4.881; 20 -2.25,-4.881; 21 -1.75,-4.881; 22 -1.25,-4.881; 23 -0.75,-4.881; 24 -0.25,-4.881; 25 0.25,-4.881; 26 0.75,-4.881; 27 1.25,-4.881; 28 1.75,-4.881; 29 2.25,-4.881; 30 2.75,-4.881; 31 3.25,-4.881; 32 3.75,-4.881; 49 3.75,4.881; 50 3.25,4.881; 51 2.75,4.881; 52 2.25,4.881; 53 1.75,4.881; 54 1.25,4.881; 55 0.75,4.881; 56 0.25,4.881; 57 -0.25,4.881; 58 -0.75,4.881; 59 -1.25,4.881; 60 -1.75,4.881; 61 -2.25,4.881; 62 -2.75,4.881; 63 -3.25,4.881; 64 -3.75,4.881
MOFSET_SI2302CDS-T1-E3CT-ND = smd 2.9 x 3.05: P$1 0,1.375 | smd 1 x 2.5: P$4 -0.95,-1.65; P$5 0.95,-1.65
IMU_497-14946-1-ND = smd 0.23 x 1.6: P$1 -1.505,1.85; P$6 -1.505,-1.85; P$7 -1.075,-1.85; P$8 -0.645,-1.85; P$9 -0.215,-1.85; P$10 0.215,-1.85; P$11 0.645,-1.85; P$12 1.075,-1.85; P$13 1.505,-1.85; P$18 1.505,1.85; P$19 1.075,1.85; P$20 0.645,1.85; P$21 0.215,1.85; P$22 -0.215,1.85; P$23 -0.645,1.85; P$24 -1.075,1.85 | smd 1.6 x 0.23: P$2 -2.1,0.645; P$3 -2.1,0.215; P$4 -2.1,-0.215; P$5 -2.1,-0.645; P$14 2.1,-0.645; P$15 2.1,-0.215; P$16 2.1,0.215; P$17 2.1,0.645
ANTENNA-CHIP5 = smd 1.016 x 2.54: FEED -3.302,0; NC 3.302,0
MOTOR_PADS = smd 2 x 2: V+ -1,0; V- 2,0
SOT23-DBV = smd 0.55 x 1.2: 1 -0.95,-1.3; 2 0,-1.3; 3 0.95,-1.3; 4 0.95,1.3; 5 -0.95,1.3
CRYSTAL-SMD-5X3 = smd 1.9 x 1.1: 1 -1.85,-1.15; 2 1.85,-1.15; 3 1.85,1.15; 4 -1.85,1.15

### Placement (x,y rotation side)
B2  40.85,41.04 0 top
BATT1  66.06,69.87 0 bottom
C1  48.98,48.79 180 top
C2  51.39,33.61 180 top
C5  38.95,37.23 270 top
C6  40.98,37.74 90 top
C7  62.06,42.06 180 top
C8  61.36,37.04 270 top
C9  24.15,71.14 90 top
C10  66.38,25.42 180 top
C11  111.47,66.06 270 top
C12  70.83,111.78 0 top
C13  105.05,89.62 0 top
C16  52.03,53.3 180 top
C17  104.16,67.97 270 top
C18  55.71,53.3 0 top
C19  68.67,104.16 0 top
C21  68.67,31.2 180 top
C23  33.04,68.92 90 top
C24  49.11,94.19 180 top
C25  52.22,88.03 270 top
C26  49.04,86.89 0 top
C27  63.71,70.89 180 top
C28  64.28,74.95 0 top
C29  66.7,72.92 180 top
C30  70.51,72.79 0 top
C31  67.78,74.95 180 top
D1  118.13,69.56 180 top
D2  66.38,118.45 270 top
D3  70.83,18.76 270 top
D4  18.12,66.7 90 top
DEBUGGING_HEADER  34.31,80.03 90 top
FRONT_LED_1  84.73,104.1 180 top
FRONT_LED_2  47.33,103.84 0 top
J4  102.89,48.6 270 top
JP2  105.12,92.42 90 top
JP3  83.84,33.04 0 top
NET_BRIDGE  61.62,83.84 90 bottom
POWER_SWITCH  71.14,90.07 180 top
R2  62.95,68.86 180 top
R3  63.71,66.82 0 top
R4  83.59,105.94 0 top
R7  113.05,68.92 0 top
R8  113.69,66.06 90 top
R9  66.38,112.74 90 top
R10  70.83,114.01 180 top
R11  70.83,24.47 270 top
R12  66.38,23.2 0 top
R13  25.11,67.33 180 top
R14  26.38,71.14 270 top
R15  48.73,105.81 180 top
R16  104.99,87.59 180 top
SW1  81.56,74.76 180 top
U2  53.74,41.11 0 top
U$1  118.13,66.06 270 top
U$2  70.83,118.13 0 top
U$3  66.38,18.76 180 top
U$4  19.71,71.14 90 top
U$5  68.6,68.6 0 top
U$7  [DOGE]  32.15,51.58 0 top
U$8  34.12,40.73 180 top
U$9  67.97,124.8 0 top
U$10  13.99,68.29 90 top
U$11  124.48,69.24 270 top
U$12  68.92,12.72 180 top
VOLTAGE_REGULATOR  49.11,90.57 180 top
Y2  54.12,50 0 top

### Tracks (layer width: path | path; a pad name or v marks a point on that pad's centre or on a via)
3.0V  (via drill 0.38, 0.4)
  Top 0.152: U$5.P$1 67.08,70.45 67.08,71.65 66.82,71.65 | 66.82,71.65 64.61,71.65 C27.1 | 65.09,65.59 64.25,65.59 63.33,66.89 R3.1 | 65.09,65.59 65.36,66.25 65.36,67.97 66.5,67.97 U$5.P$5 | U$5.P$6 U$5.P$7 U$5.P$8 | U$5.P$8 68.03,66.75 68.03,65.55 | 68.03,65.55 70.11,65.55 U$5.P$13 | 68.03,65.55 65.21,65.55 65.09,65.59 | 68.11,73.83 68.36,73.58 68.36,70.48 U$5.P$22 68.28,70.51 67.97,70.51 U$5.P$23 67.97,70.35 67.97,69.4 67.33,68.76 | 68.11,73.83 68.08,73.86 67.1,73.86 66.82,73.58 66.82,72.26 66.82,71.65 | VOLTAGE_REGULATOR.5 52.22,89.27 C25.1 52.25,88.92 53.2,88.92 | 68.6,74.95 68.6,73.84 68.13,73.84 68.11,73.83 | 67.33,68.76 66.54,68.76 U$5.P$3 64.59,68.82 64.59,68.21 64.33,67.94 63.49,67.94 62.61,68.82 62.04,68.82 R2.2 | 64,78.44 62.73,77.17 62.73,75.91 | 64,78.44 66.22,80.67 97.18,80.67 104,87.49 R16.2 | 62.73,75.91 62.73,74.95 C28.1 | 68.6,74.95 67.65,75.91 62.73,75.91 | 68.6,74.95 C31.1 | 53.05,38.76 53.05,36.38 U2.23 | 53.05,38.76 56.85,38.76 57.65,37.96 58.6,37.96 U2.34 60.79,37.86 C8.1 | 53.05,44.63 54.47,44.63 54.95,45.11 54.95,45.9 U2.54 55.11,46.06 55.11,46.85 55.58,47.33 63.52,47.33 63.52,42.06 C7.1 61.96,42.12 61.97,41.12 60.04,41.12 59.76,41.46 59.76,42.86 U2.44 58.76,42.88 | 53.05,44.63 52.57,44.63 52.57,45.9 U2.59 | v53.05,42.09 53.05,38.76 | 53.05,44.63 v53.05,44 | 53.2,88.92 53.2,86.54 52.89,86.22 52.57,86.22 52.57,83.84 v52.47,83.78 52.57,83.68 58.76,83.68 64,78.44 | 53.2,88.92 53.36,88.92 53.36,97.97 50.35,100.99 40.03,100.99 DEBUGGING_HEADER.7 | 67.33,68.76 67.97,68.76 67.97,66.86 U$5.P$8
  Bottom 0.152: v53.05,42.09 v53.05,44 52.57,44.47 52.57,83.68 v52.47,83.78
  pour Route15: 43.2,44.47 43.14,85.11 93.94,85.11 94,43.2 50.82,43.2 50.82,64.09 73.37,64.09 73.3,72.79 64.03,72.73 63.97,65.05 49.43,65.11 49.55,44.47
AVDD
  Top 0.152: U2.60 51.99,47.3 51.62,47.68 50.99,47.68 C1.1
BAT_GND  (via drill 0.38, 0.4)
  Top 0.457: U$1.P$5 116.39,65.11 113.85,65.11 R8.1 111.46,65.11 C11.2 111.31,65.27 110.67,65.9 108.13,65.9 v107.97,66.06 105.27,66.06 104.16,64.95 C17.2 | U$4.P$5 21.45,72.1 23.99,72.1 C9.2 24.15,72.1 R14.1 26.53,71.94 27.17,71.3 29.07,71.3 v29.23,71.14 32.25,71.14 33.04,71.94 C23.2 | U$2.P$5 71.78,116.39 71.78,114.16 R10.1 71.78,111.78 C12.2 71.94,111.62 71.94,109.08 v71.9,108.86 71.78,108.77 C19.2 | C21.2 65.43,31.14 65.43,27.96 v64.86,27.84 64.95,27.8 65.27,27.8 65.27,25.58 C10.2 65.43,25.42 R12.1 65.43,23.04 65.43,20.5 U$3.P$5 | v52.41,93.21 50.98,93.21 50.03,94.16 C24.1
  Bottom 0.457: 71.78,108.77 v71.9,108.86 | NET_BRIDGE.P$2 66.06,84.74 BATT1.- 67.17,85.59 67.17,87.94 v65.62,89.49
  pour Route2: 30.5,49.87 30.5,106.7 106.7,106.7 106.7,30.5 52.09,30.5 52.09,40.66 96.54,40.66 96.42,87.46 40.54,87.46 40.66,49.87
  pour Route2: 64.16,127.66 73.05,127.66 73.05,106.7 64.16,106.7
  pour Route2: 64.16,9.55 73.05,9.55 73.05,30.5 64.16,30.5
  pour Route2: 127.66,73.05 127.66,64.16 106.7,64.16 106.7,73.05
  pour Route2: 11.45,73.05 30.5,73.05 30.5,64.16 11.45,64.16
DTR
  Top 0.152: JP2.DTR 104.16,92.41 104.16,89.72 C13.1
DVDD
  Top 0.152: U2.22 U2.21 52.29,36.23 C2.1
FILTERED1
  Top 0.457: C9.1 R13.2 | R14.2 24.31,70.19 C9.1 | U$4.P$4 21.45,70.19 23.99,70.19 C9.1
FILTERED2
  Top 0.457: R10.2 66.54,114.01 66.38,113.85 R9.2 | C12.1 69.87,111.78 69.87,113.85 R10.2 | U$2.P$4 69.87,116.39 69.87,114.16 R10.2
FILTERED3
  Top 0.457: R12.2 67.33,25.42 C10.1 | R11.2 67.49,23.52 R12.2 | U$3.P$4 67.33,20.5 67.33,23.04 R12.2
FILTERED4
  Top 0.457: R8.2 113.69,68.92 R7.2 | C11.1 111.46,67.02 113.53,67.02 R8.2 | U$1.P$4 116.39,67.02 113.85,67.02 R8.2
FLYBACK1
  Top 0.457: D4.A 18.12,71.14 U$4.P$1 17.96,70.35 13.99,70.35 U$10.V-
FLYBACK2
  Top 0.457: D2.A 66.38,116.86 68.92,119.4 70.83,119.4 U$2.P$1 70.03,119.56 70.03,124.8 U$9.V-
FLYBACK3
  Top 0.457: D3.A 70.83,17.17 70.67,17.33 66.38,17.33 U$3.P$1 67.02,17.17 67.02,12.72 U$12.V-
FLYBACK4
  Top 0.457: D1.A 116.55,69.56 119.4,66.7 119.4,66.06 U$1.P$1 119.56,66.86 124.16,66.86 124.48,67.17 U$11.V-
GND  (via drill 0.38, 0.4)
  Top 0.152: 51.49,35.12 51.49,35.2 | 51.49,35.2 U2.20 51.46,36.38 51.46,40.34 50.03,40.34 | C27.2 62.76,70.89 62.76,72.92 | 62.76,72.92 C29.2 66,72.92 66,74.95 | 66,74.95 C28.2 | 66,74.95 C31.2 | U$5.P$14 U$5.P$15 U$5.P$16 U$5.P$17 71.84,69.25 | 71.84,69.25 71.84,69.24 | 71.84,69.25 71.84,70.19 | 71.84,70.19 71.84,71.65 71.4,71.65 | U$5.P$18 70.11,71.65 | 71.4,71.65 70.11,71.65 | 70.11,71.65 69.68,71.65 | 69.68,71.65 69.25,71.65 U$5.P$20 | 69.68,71.65 U$5.P$19 | 71.4,71.65 C30.2 71.3,72.89 71.3,76.86 v63.68,76.86 | C26.2 49.94,83.78 v49.87,83.78 49.87,83.68 50.66,82.89 52.73,82.89 v62.09,73.52 62.73,72.89 62.76,72.92 | C26.2 52.22,86.89 C25.2 | 84.48,105.91 R4.2 | 84.79,105.75 85.43,105.12 JP2.GND | 84.79,105.75 84.64,105.91 R4.2 | U2.33 58.76,37.49 59.55,37.49 59.55,36.15 | 58.76,38.28 U2.35 | 57.49,43.04 57.81,43.36 58.6,43.36 U2.45 60.49,43.36 60.53,43.32 C7.2 | 57.49,43.04 57.49,38.6 57.65,38.44 58.6,38.44 U2.35 | U2.24 53.36,36.22 53.36,32.57 50.98,32.57 50.98,33.61 C2.2 50.5,35.2 51.49,35.2 | 48.92,40.34 48.92,39.87 U2.11 | 49.71,41.77 48.92,41.77 U2.7 | 49.71,41.77 50.03,41.46 50.03,40.34 | 48.92,40.34 50.03,40.34 | 48.92,40.34 U2.10 | 50.98,43.04 51.46,43.52 51.46,45.9 U2.61 51.49,47.37 49.55,47.37 48.13,48.79 C1.2 48.28,48.79 48.28,53.2 50.98,53.2 C16.2 51.5,53.3 52.43,54.24 52.78,54.24 v53.87,55.33 54.96,54.24 55.31,54.24 56.24,53.3 C18.2 56.7,53.2 57.17,53.2 57.17,50.5 57.01,50.35 54.47,50.35 54.47,46.06 U2.55 54.47,45.9 54.47,45.11 54.32,44.95 53.05,44.95 53.05,45.9 U2.58 | 50.98,43.04 49.71,41.77 | 50.98,43.04 57.49,43.04 | 48.28,103.05 48.28,104.48 48.12,104.64 47.81,104.64 47.81,105.75 R15.2
  Top 0.152: 71.84,70.19 79.24,70.19 SW1.3 79.4,70.35 79.4,79.24 SW1.4 | 71.78,70.19 71.84,70.19 | 49.24,90.99 49.24,87.02 49.87,87.02 C26.2 | 49.24,90.99 49.24,91.78 VOLTAGE_REGULATOR.2 | 49.24,90.99 47.33,90.99 44.47,93.84 32.57,93.84 32.57,101.15 DEBUGGING_HEADER.10 48.12,102.89 48.28,103.05 | 48.28,103.05 49.87,103.05 50.35,102.57 83.37,102.57 83.37,104.32 84.79,105.75 | U2.35 59.78,38.36 60.13,38.71 62.98,38.71 62.95,38.16 62.95,36.85 | 62.95,36.85 62.95,36.79 61.36,36.79 C8.2 59.55,36.15 | 59.55,36.15 58.7,36.15 v58.7,35.96 | JP3.GND 94.16,35.42 64.32,35.42 62.89,36.85 62.95,36.85 | 84.79,105.75 R4.2 | v44.6,45.3 44.6,42.76 v44.66,42.69
  Bottom 0.152: JP3.GND 104.16,40.66 J4.6 | NET_BRIDGE.P$1 62.09,83.37 62.09,76.86 | v62.09,73.52 62.09,76.86 | 62.09,76.86 v63.68,76.86
  other vias: 43.01,42.69 41.81,43.52 46.38,39.84 44.66,39.84 42.95,39.84 46.38,42.69 39.96,43.52 38.06,43.52 37.87,34.63 39.77,34.63 41.68,34.63 42.89,35.71 42.95,38.38 43.65,37.04
  pour Route2: 43.2,44.47 43.14,85.11 93.94,85.11 94,43.2 50.82,43.2 50.89,64.09 73.37,64.09 73.3,72.79 64.09,72.73 63.97,65.05 49.43,65.11 49.55,44.47
  pour Route2: 65.55,71.4 71.65,71.4 71.65,65.81 65.55,65.81
  pour Route2: 36.85,49.17 42.44,49.17 42.44,43.84 47.01,43.84 47.01,30.5 36.85,30.5
  pour Top: 36.85,49.17 36.85,30.5 47.01,30.5 47.01,43.84 42.44,43.84 42.44,49.17
MISO
  Top 0.152: J4.1 90.83,40.34 58.76,40.34 U2.39
MOSI
  Top 0.152: J4.4 102.89,49.87 101.15,49.87 91.15,39.87 58.76,39.87 U2.38
N$1
  Top 0.152: FRONT_LED_1.P$2 82.41,104.16 82.41,105.91 82.57,105.91 R4.1
N$2
  Top 0.152: C30.1 68.82,72.79 U$5.P$21
N$4
  cutout Route15: 65.55,71.4 71.65,71.4 71.65,65.81 65.55,65.81
N$5
  Top 0.152: FRONT_LED_2.P$2 49.71,103.84 49.71,105.75 R15.1
N$7
  Top 0.152: C6.2 40.85,38.64 B2.2
N$10
  Top 0.152: C29.1 67.53,72.92 U$5.P$24
N$12
  Top 0.152: C16.1 53.49,53.3 53.49,48.98 | 53.49,48.98 U2.57 | 53.49,48.98 52.27,48.98 Y2.1
N$14
  Top 0.152: C18.1 53.99,53.3 53.99,51.15 | 53.99,51.15 U2.56 | Y2.3 53.99,51.15
N$18
  Top 0.152: VOLTAGE_REGULATOR.4 48.12,89.24 48.12,87.02 C26.1
PB5
  Top 0.152: 33.84,70.19 29.07,70.19 26.22,67.33 R13.1 | 33.84,70.19 34.63,70.98 34.63,77.17 32.88,78.92 32.88,92.73 DEBUGGING_HEADER.6 | 33.84,70.19 47.89,56.14 55.19,56.14 57.48,53.86 57.48,50.38 57.14,50.04 54.79,50.04 54.79,47.63 63.65,47.63 63.83,47.46 63.83,41.5 63.16,40.83 62.1,40.82 61.98,40.82 61.85,40.81 61.85,40.82 60.15,40.82 60.14,40.8 60.03,40.82 59.92,40.82 59.9,40.83 59.89,40.83 59.82,40.92 59.74,40.99 59.44,41.36 U2.41
PE3  (via drill 0.38)
  Top 0.152: v70.83,29.23 R11.1 | v62.57,44.31 61.46,45.43 57.97,45.43 57.49,45.9 U2.49
  Bottom 0.152: 62.57,37.49 v70.83,29.23 | v62.57,44.31 62.57,37.49 | DEBUGGING_HEADER.4 33.2,86.54 33.2,59.24 43.84,48.6 43.84,46.54 45.14,46.54 47.65,44.03 47.65,36.98 53.36,36.98 | 53.36,36.98 53.36,34.31 54,33.68 62.57,33.68 62.57,37.49 | 53.36,36.98 53.36,37.01
PE4  (via drill 0.38)
  Top 0.152: DEBUGGING_HEADER.3 33.2,85.11 33.2,79.08 47.17,65.11 v59.24,65.11 70.19,65.11 72.1,67.02 110.04,67.02 111.94,68.92 R7.1 | v58.44,46.38 57.81,47.01 57.01,47.01 57.01,46.06 U2.50
  Bottom 0.152: v58.44,46.38 59.87,47.81 59.87,64.47 v59.24,65.11
PE5  (via drill 0.38)
  Top 0.152: v66.38,109.08 R9.1 | v55.58,44.47 55.74,44.47 56.38,45.11 56.38,45.9 U2.51
  Bottom 0.152: v66.38,109.08 66.06,108.77 66.06,108.13 48.12,90.19 | DEBUGGING_HEADER.5 48.12,90.19 | v55.58,44.47 54.79,45.27 54.79,83.52 48.12,90.19
RESET  (via drill 0.38)
  Top 0.152: C13.2 106.07,89.56 106.07,87.65 R16.1 105.91,87.49 97.81,79.4 83.84,79.4 SW1.2 83.84,79.24 83.84,70.35 SW1.1 83.84,70.19 v83.84,67.97 | J4.5 101.62,36.38 96.7,31.33 83.3,31.33 82.41,32.73 64.47,32.73 64,32.25 47.81,32.25 47.81,39.08 47.97,39.23 48.76,39.23 U2.12
  Bottom 0.152: v83.84,67.97 100.35,51.46 100.35,47.33 J4.5
RFANT
  Top 0.457: 38.92,40.66 37.49,40.66 U$8.FEED | 38.92,40.66 39.87,40.66 40.19,40.34 B2.1 | 38.92,40.66 38.92,38.28 C5.1
RFN
  Top 0.152: U2.9 42,40.86 42,40.85 B2.3
RFP
  Top 0.152: U2.8 41.99,41.36 B2.4
RX0  (via drill 0.38)
  Top 0.152: v61.14,43.84 58.76,43.84 U2.46
  Bottom 0.152: v61.14,43.84 61.62,44.31 61.62,54 JP2.TXO
RX1
  Top 0.152: U2.27 55.11,36.22 55.11,35.11 55.9,34.31 85.11,34.31 85.18,34.25 85.18,31.63 88.92,31.63 JP3.TXO
SCK
  Top 0.152: J4.3 92.41,39.39 58.76,39.39 U2.37
SCL  (via drill 0.38)
  Top 0.152: U$5.P$2 63.91,69.25 R2.1 63.84,69.24 63.21,69.87 61.62,69.87 v60.19,68.44 45.9,68.44 DEBUGGING_HEADER.1 | v54.32,34.63 54,34.63 U2.25
  Bottom 0.152: v54.32,34.63 60.19,40.5 v60.19,68.44
SDA  (via drill 0.38)
  Top 0.152: U$5.P$4 66.5,68.41 64.98,68.41 64.98,66.89 R3.2 64.1,66.82 63.18,67.74 62.34,67.74 61.93,67.33 v46.22,67.33 | v54.47,37.81 54.47,36.38 U2.26
  Bottom 0.152: v54.47,37.81 44.15,48.12 44.15,67.33 | 44.15,67.33 44.15,72.73 DEBUGGING_HEADER.2 | 44.15,67.33 v46.22,67.33
TX0  (via drill 0.38)
  Top 0.152: v57.01,44.47 58.6,44.47 U2.47
  Bottom 0.152: v57.01,44.47 57.49,44.95 57.49,67.65 88.61,98.77 106.38,98.77 106.38,96.22 105.12,96.22 JP2.RXI
TX1
  Top 0.152: 86.86,35.11 86.76,35.11 | 86.76,35.11 55.58,35.11 55.58,36.22 U2.28 | 86.76,35.11 87.14,35.11 87.14,33.8 JP3.RXI
V
  Bottom 0.457: BATT1.+ POWER_SWITCH.2
VBAT  (via drill 0.4)
  Top 0.457: U$10.V+ 13.99,67.17 16.06,67.17 18.12,65.11 D4.C 18.28,65.27 19.23,66.22 27.33,66.22 27.96,66.86 v28.03,67.08 28.12,67.02 31.93,67.02 33.04,65.9 C23.1 | U$11.V+ 124.48,70.19 120.51,70.19 119.88,69.56 D1.C 119.72,69.71 117.81,71.62 108.45,71.62 v108.29,71.84 108.29,71.78 104.8,71.78 104.16,71.14 C17.1 | U$9.V+ 66.38,124.8 D2.C 66.22,120.04 66.22,117.81 65.9,117.81 65.27,117.18 65.27,108.61 v65.11,108.48 65.11,108.45 65.43,108.45 65.43,104.16 C19.1 | 48.12,93.37 48.12,94.16 C24.2 | 48.12,93.37 48.12,92.89 | 48.12,92.89 48.12,91.94 VOLTAGE_REGULATOR.3 | 48.12,92.89 50.03,92.89 50.03,91.94 VOLTAGE_REGULATOR.1 | FRONT_LED_2.P$1 46.06,105.12 v45.36,105.12 | FRONT_LED_1.P$1 84.79,104 85.43,103.37 85.43,90.19 71.14,90.19 POWER_SWITCH.1 | U$12.V+ 70.03,12.72 70.03,16.06 71.3,16.06 71.62,16.37 71.62,20.34 70.98,20.34 D3.C 70.83,22.56 71.46,22.56 72.41,23.52 v72.41,27.77 72.41,27.96 71.94,27.96 71.94,31.14 C21.1 | 48.12,93.37 46.22,93.37 v46.12,93.43
  pour Route15: 30.5,49.87 30.5,106.7 106.7,106.7 106.7,30.5 52.09,30.5 52.09,40.66 96.54,40.66 96.42,87.53 40.54,87.53 40.66,49.87
  pour Route15: 64.16,127.66 73.05,127.66 73.05,106.7 64.16,106.7
  pour Route15: 11.45,73.05 30.5,73.05 30.5,64.16 11.45,64.16
  pour Route15: 64.16,9.55 64.16,30.5 73.05,30.5 73.05,9.55
  pour Route15: 106.7,73.05 127.66,73.05 127.66,64.16 106.7,64.16

### Text on the board
tPlace: GND | BAT_GND | VBAT | 3.0V | PB5 | PE5 | PE3 | PE4 | SDA | SCL
bPlace: GND | BAT_GND | VBAT | 3.0V | PB5 | PE5 | PE3 | PE4 | SDA | SCL